# Altium project Evb board STM32H7 Fullcolor V1l0.PrjPcb (part 1 of 2)
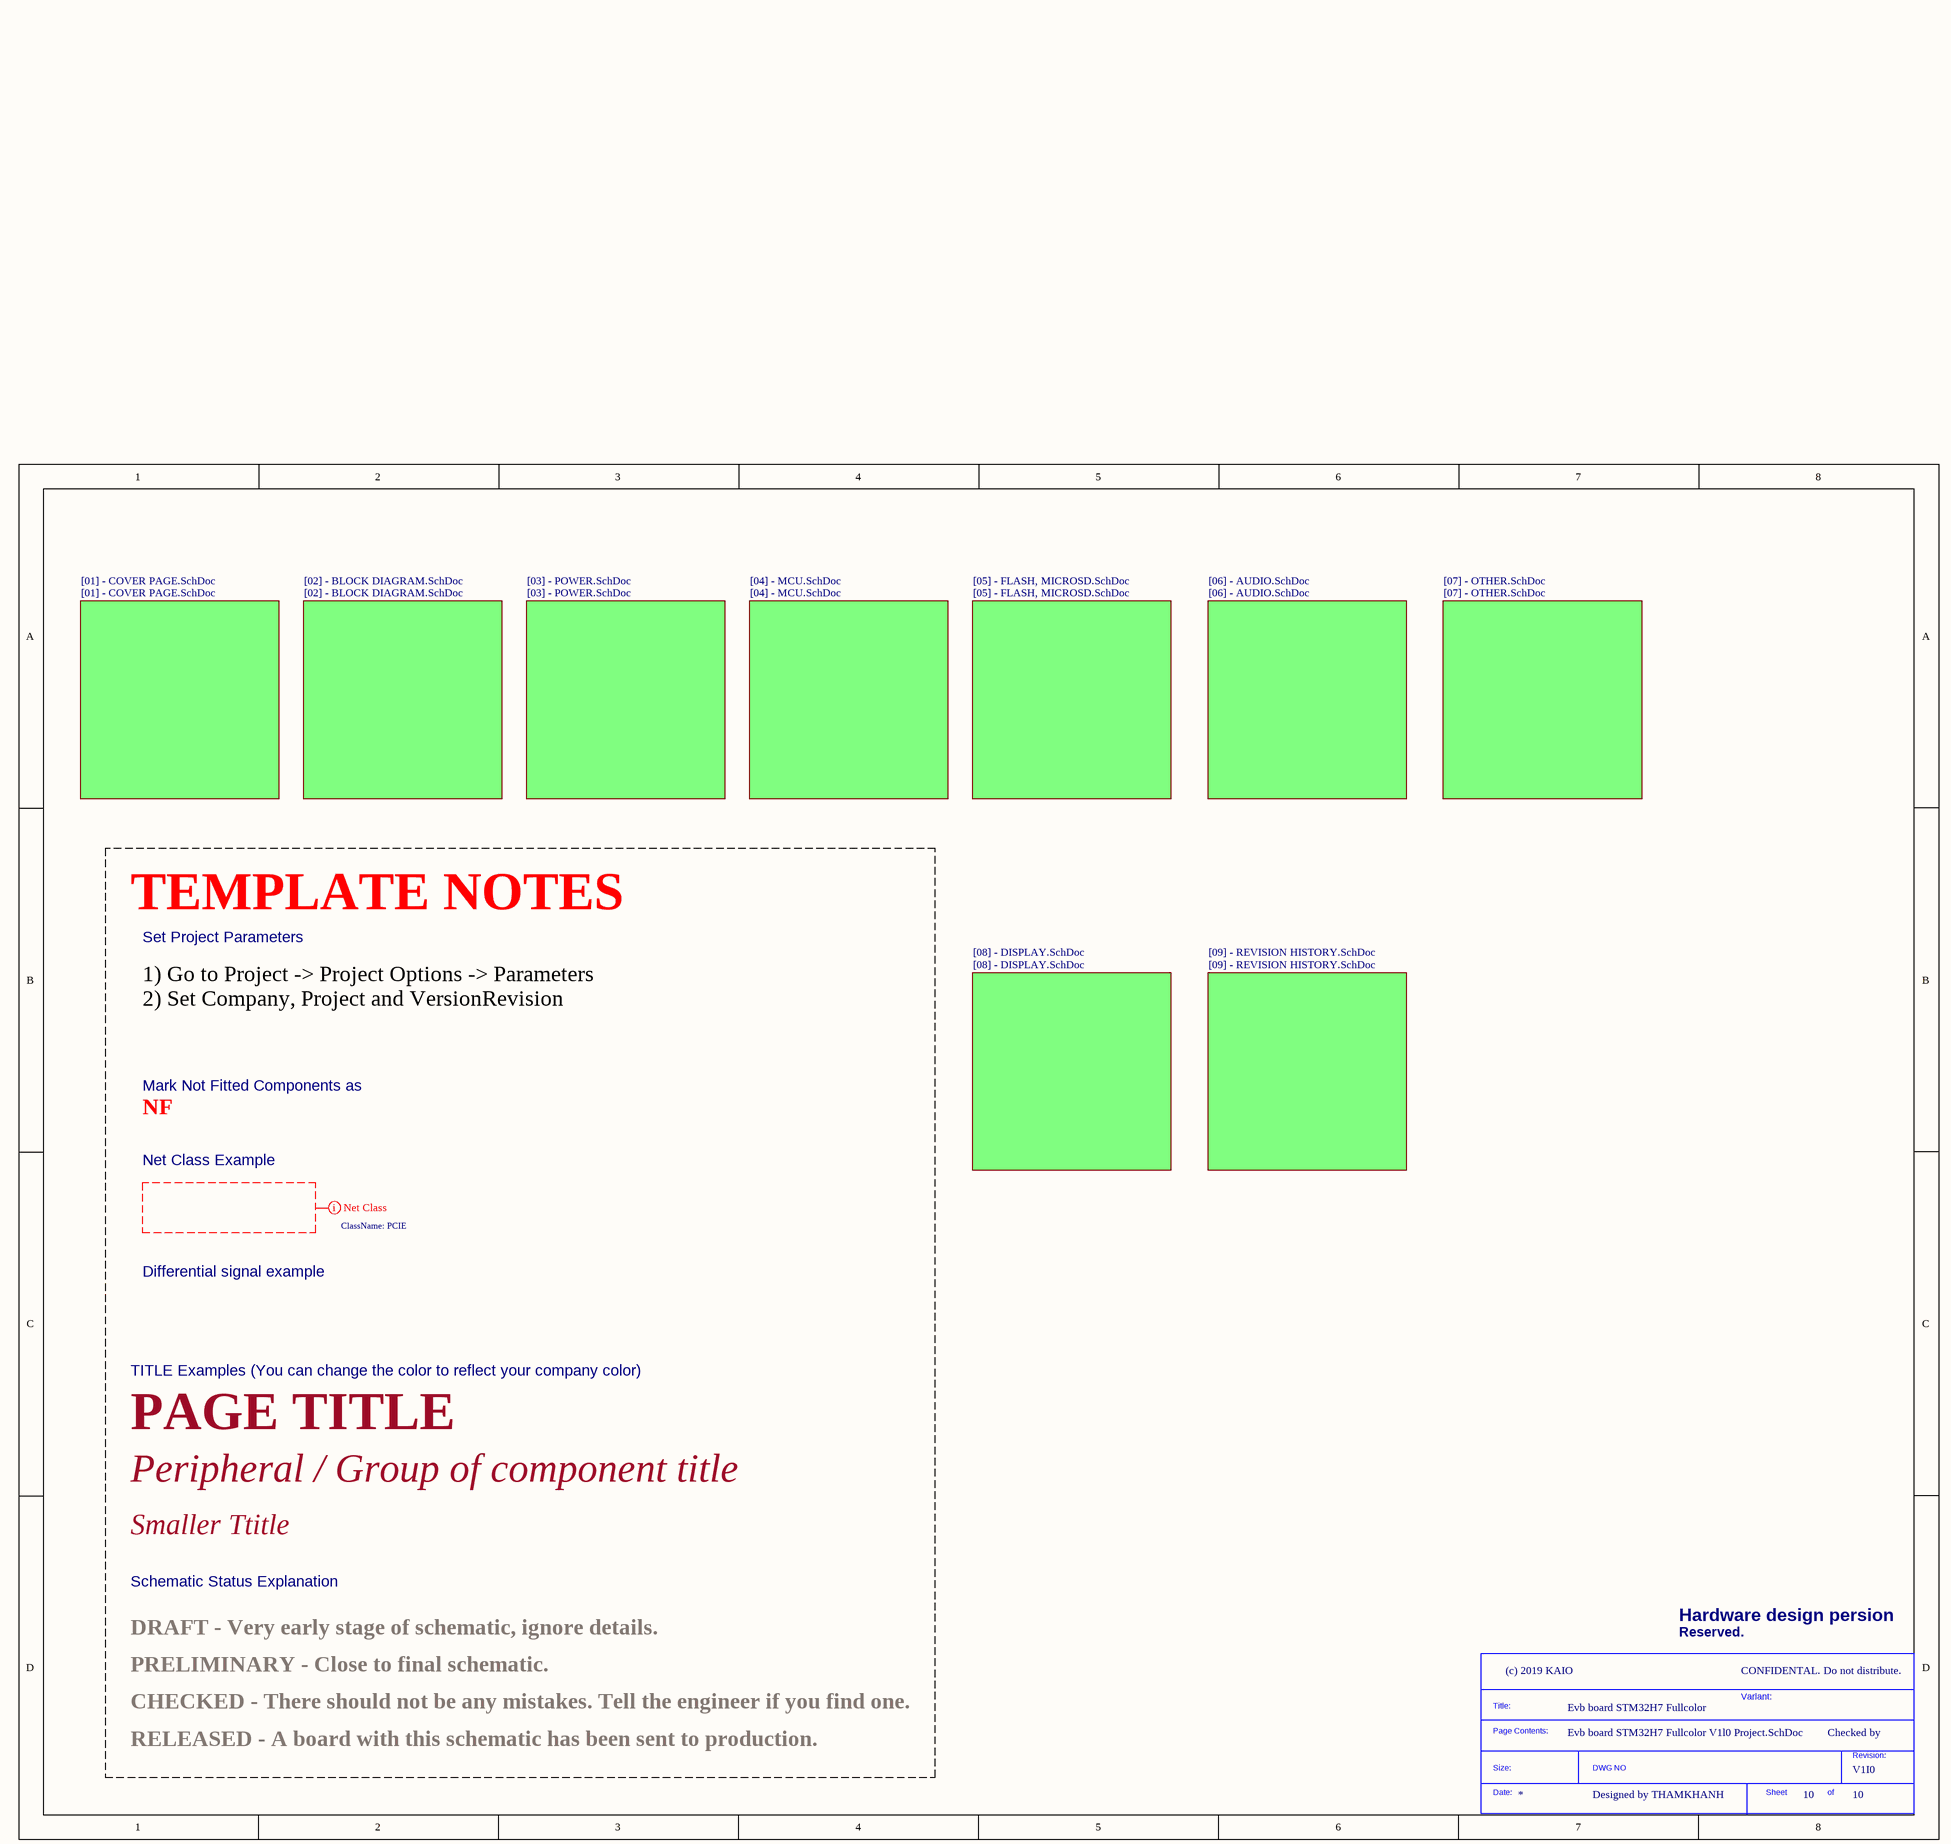
[diagram p0: Evb board STM32H7 Fullcolor V1l0 Project.SchDoc]
ClientCompanyName: KAIO; ClientContactEmail: thamkhanhdev@gmail.com; ClientContactName: Khanh Tham; ClientWebsite: Reserved; Company: (c) 2019 KAIO; Note: FREE for personal.; NotFitted: NF; Project: Evb board STM32H7 Fullcolor; VersionRevision: V1I0
10 sheets, 65 parts. Net scope: flat (ports and power ports of the same name join across sheets).
Board file: Evb board STM32H7 Fullcolor V1l0.PcbDoc
Sheets:
  Evb board STM32H7 Fullcolor V1l0 Project.SchDoc
    [01] - COVER PAGE.SchDoc = [01] - COVER PAGE.SchDoc
    [02] - BLOCK DIAGRAM.SchDoc = [02] - BLOCK DIAGRAM.SchDoc
    [03] - POWER.SchDoc = [03] - POWER.SchDoc
    [04] - MCU.SchDoc = [04] - MCU.SchDoc
    [05] - FLASH, MICROSD.SchDoc = [05] - FLASH, MICROSD.SchDoc
    [06] - AUDIO.SchDoc = [06] - AUDIO.SchDoc
    [07] - OTHER.SchDoc = [07] - OTHER.SchDoc
    [09] - REVISION HISTORY.SchDoc = [09] - REVISION HISTORY.SchDoc
    [08] - DISPLAY.SchDoc = [08] - DISPLAY.SchDoc

## Sheet Evb board STM32H7 Fullcolor V1l0 Project.SchDoc
size A3; CompanyName: FEDEVEL; Organization: FEDEVEL; DocumentNumber: 1; Revision: V1I1; SheetNumber: 10; SheetTotal: 10; PageSetup: Record=PageOptions|CenterHorizontal=True|CenterVertical=True|PrintScale=1.07|XCorrection=1.00|YCorrection=1.00|PrintKind=1|BorderSize=5000000|LeftOffset=0|BottomOffset=0|Orientation=2|PaperLength=1000|PaperWidth=1000|Scale=100|PaperSource=7|PrintQuality=600|MediaType=1|DitherType=10|PaperKind=A3|PrintScaleMode=1; ProjectName: KDS C6A816x Module

### Parts
*  SDTitleBlock  (value not drawn)  (graphical)

### Sub-sheets
[01] - COVER PAGE.SchDoc = [01] - COVER PAGE.SchDoc: no entries
[02] - BLOCK DIAGRAM.SchDoc = [02] - BLOCK DIAGRAM.SchDoc: no entries
[03] - POWER.SchDoc = [03] - POWER.SchDoc: no entries
[04] - MCU.SchDoc = [04] - MCU.SchDoc: no entries
[05] - FLASH, MICROSD.SchDoc = [05] - FLASH, MICROSD.SchDoc: no entries
[06] - AUDIO.SchDoc = [06] - AUDIO.SchDoc: no entries
[07] - OTHER.SchDoc = [07] - OTHER.SchDoc: no entries
[08] - DISPLAY.SchDoc = [08] - DISPLAY.SchDoc: no entries
[09] - REVISION HISTORY.SchDoc = [09] - REVISION HISTORY.SchDoc: no entries

### Layout directives
net class PCIE: (no net found under the mark)

### Notes on the sheet
- TEMPLATE NOTES
- Set Project Parameters
- 1) Go to Project -> Project Options -> Parameters
  2) Set Company, Project and VersionRevision
- NF
- Mark Not Fitted Components as
- Net Class Example
- Differential signal example
- TITLE Examples (You can change the color to reflect your company color)
- PAGE TITLE
- Peripheral / Group of component title
- Smaller Ttitle
- Schematic Status Explanation
- Hardware design persion
- PRELIMINARY - Close to final schematic.
- DRAFT - Very early stage of schematic, ignore details.
- Reserved.
- CONFIDENTAL. Do not distribute.
- CHECKED - There should not be any mistakes. Tell the engineer if you find one.
- Variant:
- Checked by
- RELEASED - A board with this schematic has been sent to production.
- Designed by THAMKHANH
- (in symbol SDTitleBlock) Title:; Page Contents:; Revision:; Size:; DWG NO; Date:; Sheet; of

## Sheet [01] - COVER PAGE.SchDoc
size A3; DocumentNumber: 2; SheetNumber: 1; SheetTotal: 10
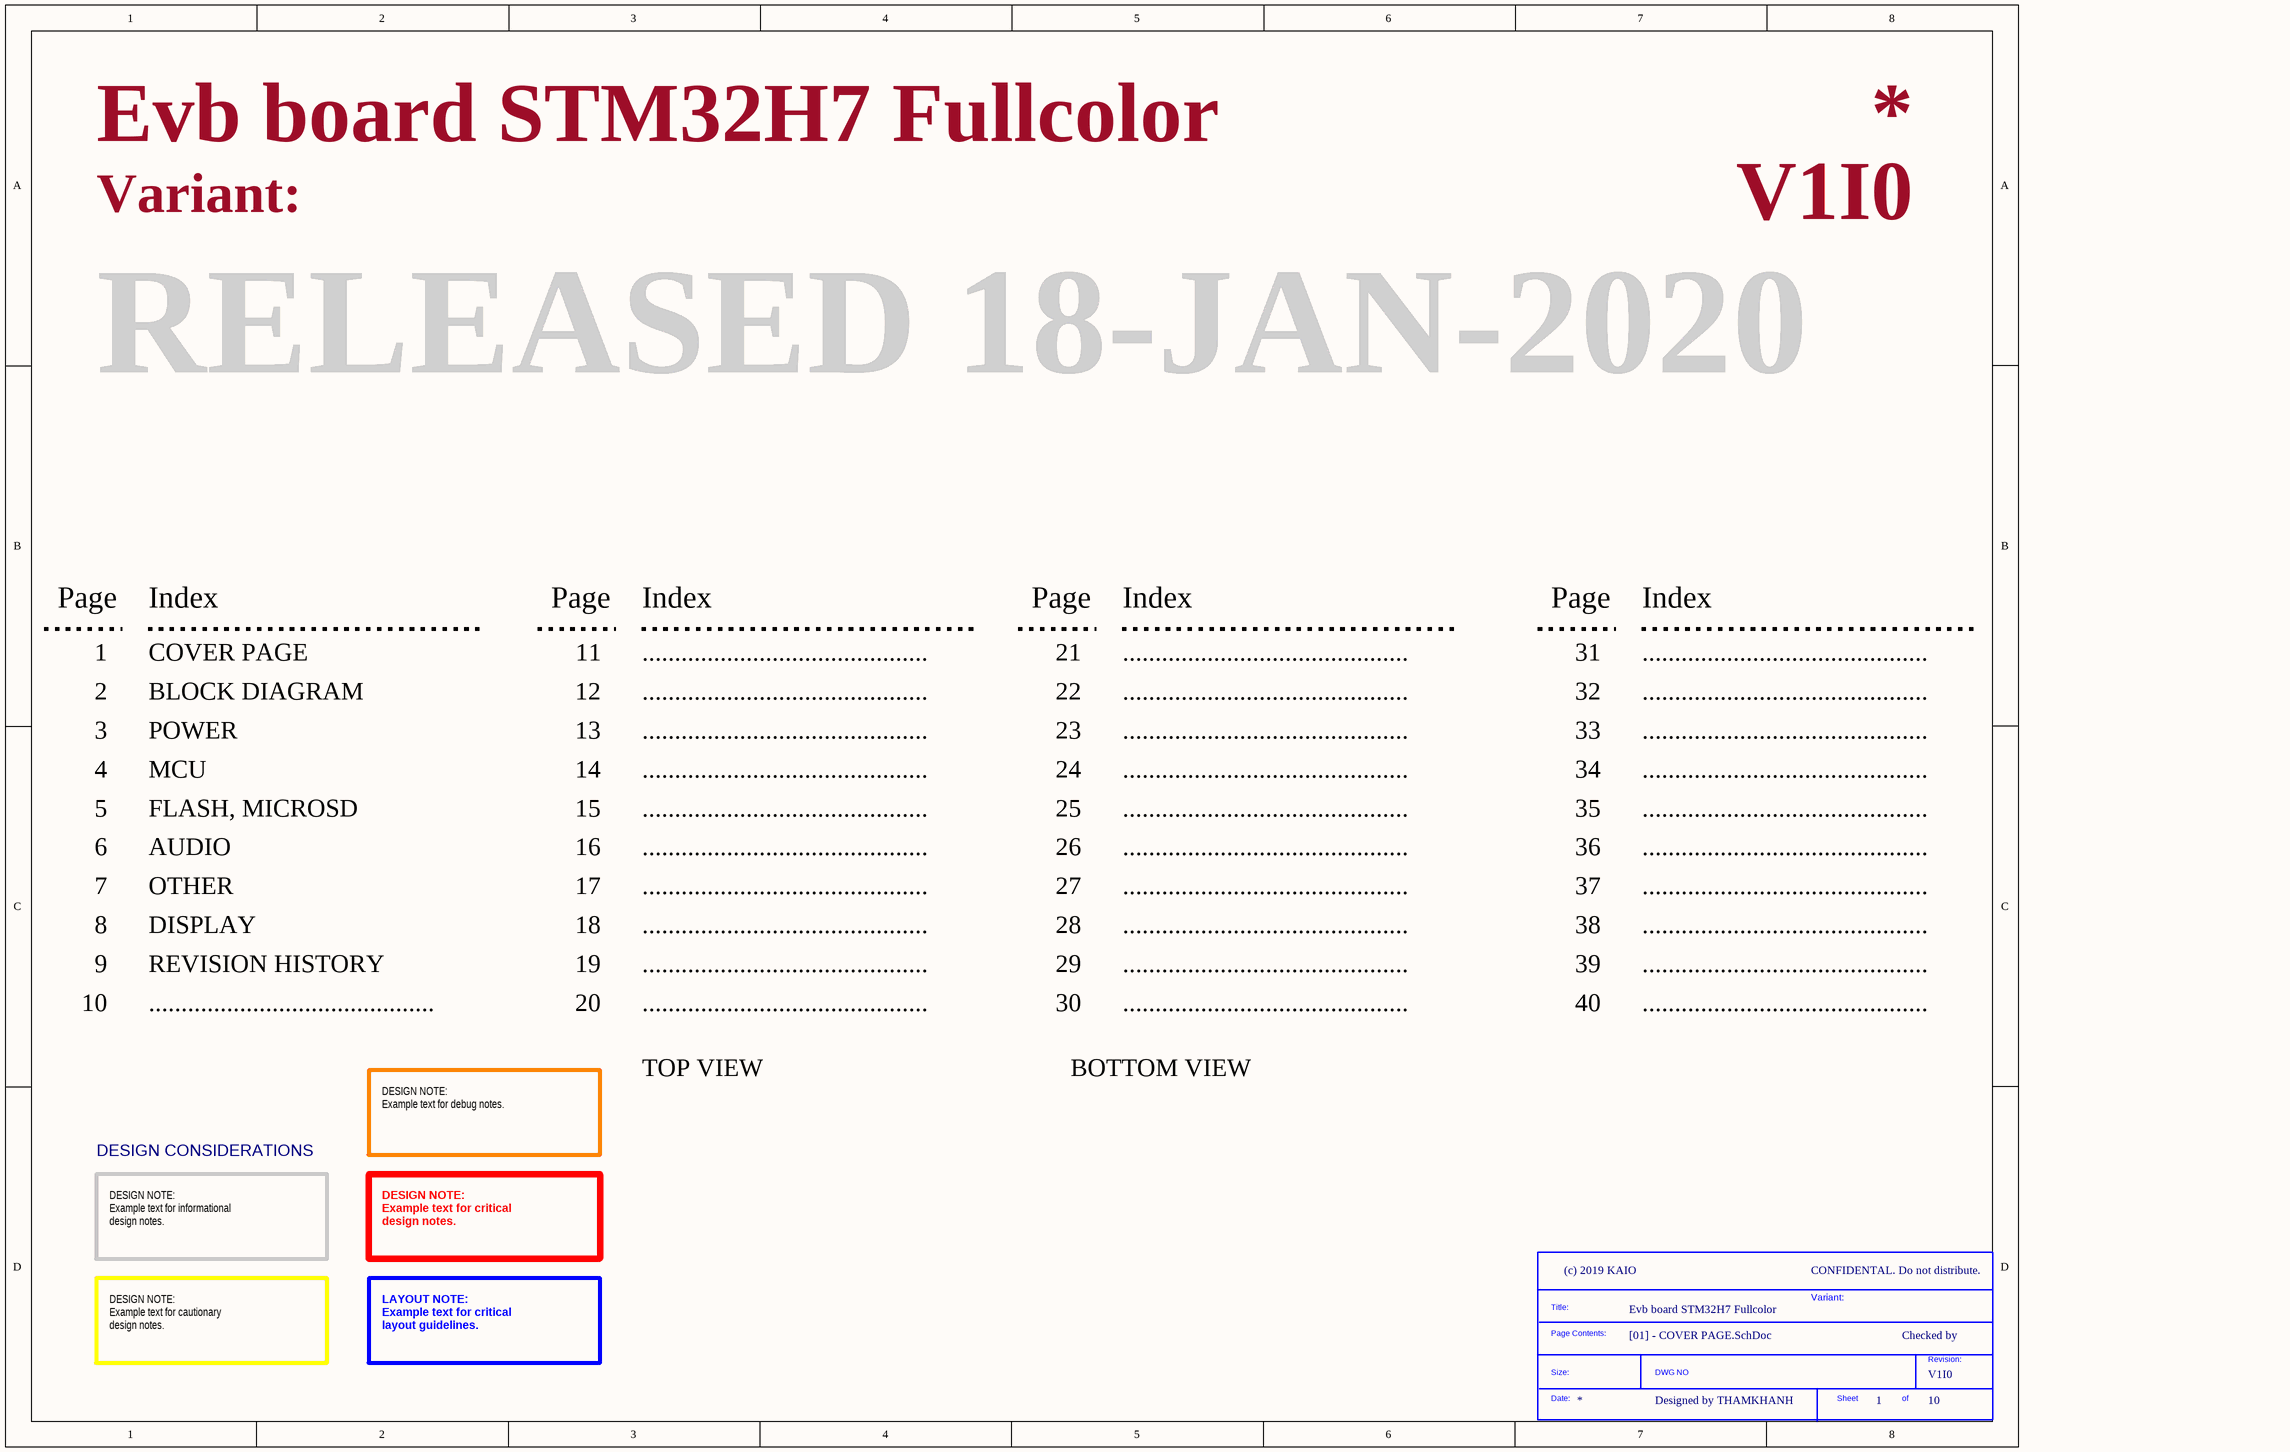
[diagram p1: [01] - COVER PAGE.SchDoc]

### Parts
(Parts that share a designator on the sheet are numbered #1, #2 ... from top to bottom, then left to right.)
*?#1  SDTitleBlock  (value not drawn)  (graphical)

### Notes on the sheet
- Variant:
- RELEASED 18-JAN-2020
- Page
- Index
- 1
- COVER PAGE
- 11
- ............................................
- 21
- 31
- 2
- 3
- BLOCK DIAGRAM
- POWER
- 12
- 13
- 22
- 23
- 32
- 33
- 4
- 5
- MCU
- FLASH, MICROSD
- 14
- 15
- 24
- 25
- 34
- 35
- 6
- AUDIO
- 16
- 26
- 36
- 7
- 8
- DISPLAY
- OTHER
- 17
- 18
- 27
- 28
- 37
- 38
- 9
- 10
- REVISION HISTORY
- 19
- 20
- 29
- 30
- 39
- 40
- TOP VIEW
- BOTTOM VIEW
- DESIGN NOTE:
  Example text for debug notes.
- DESIGN CONSIDERATIONS
- DESIGN NOTE:
  Example text for informational
  design notes.
- DESIGN NOTE:
  Example text for critical
  design notes.
- CONFIDENTAL. Do not distribute.
- Checked by
- DESIGN NOTE:
  Example text for cautionary
  design notes.
- LAYOUT NOTE:
  Example text for critical
  layout guidelines.
- Designed by THAMKHANH
- (in symbol SDTitleBlock) Title:; Page Contents:; Revision:; Size:; DWG NO; Date:; Sheet; of

## Sheet [02] - BLOCK DIAGRAM.SchDoc
size A3; DocumentNumber: 3; SheetNumber: 2; SheetTotal: 10
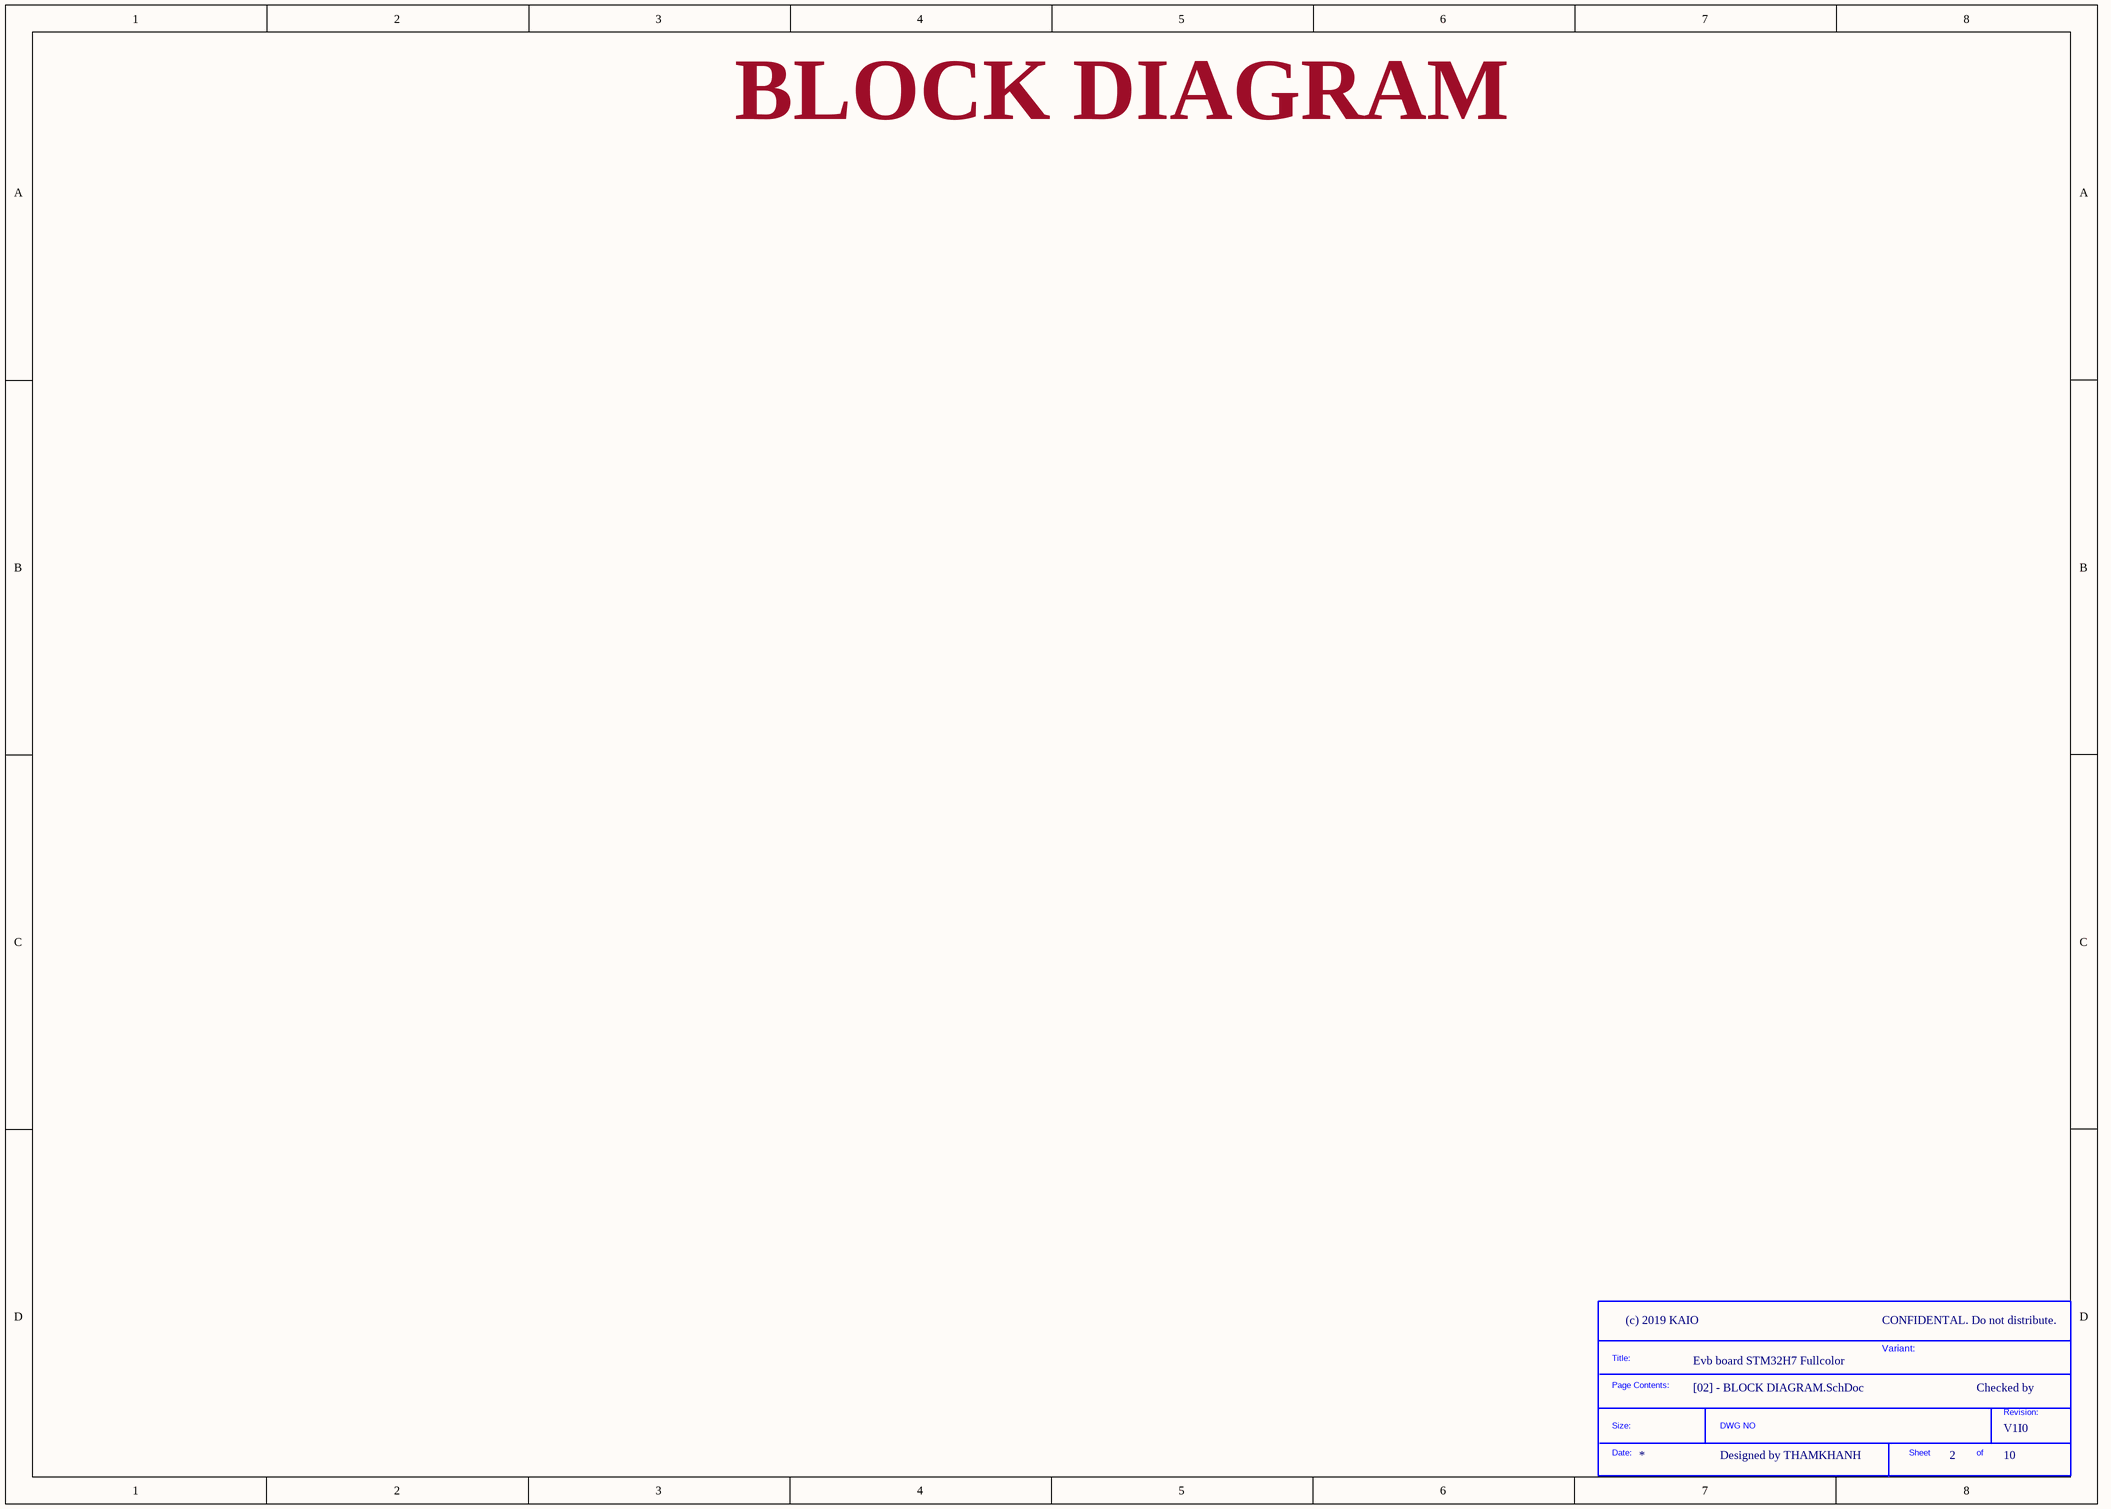
[diagram p2: [02] - BLOCK DIAGRAM.SchDoc]

### Parts
(Parts that share a designator on the sheet are numbered #1, #2 ... from top to bottom, then left to right.)
*?#2  SDTitleBlock  (value not drawn)  (graphical)

### Notes on the sheet
- BLOCK DIAGRAM
- CONFIDENTAL. Do not distribute.
- Variant:
- Checked by
- Designed by THAMKHANH
- (in symbol SDTitleBlock) Title:; Page Contents:; Revision:; Size:; DWG NO; Date:; Sheet; of

## Sheet [03] - POWER.SchDoc
size A3; DocumentNumber: 4; SheetNumber: 3; SheetTotal: 10
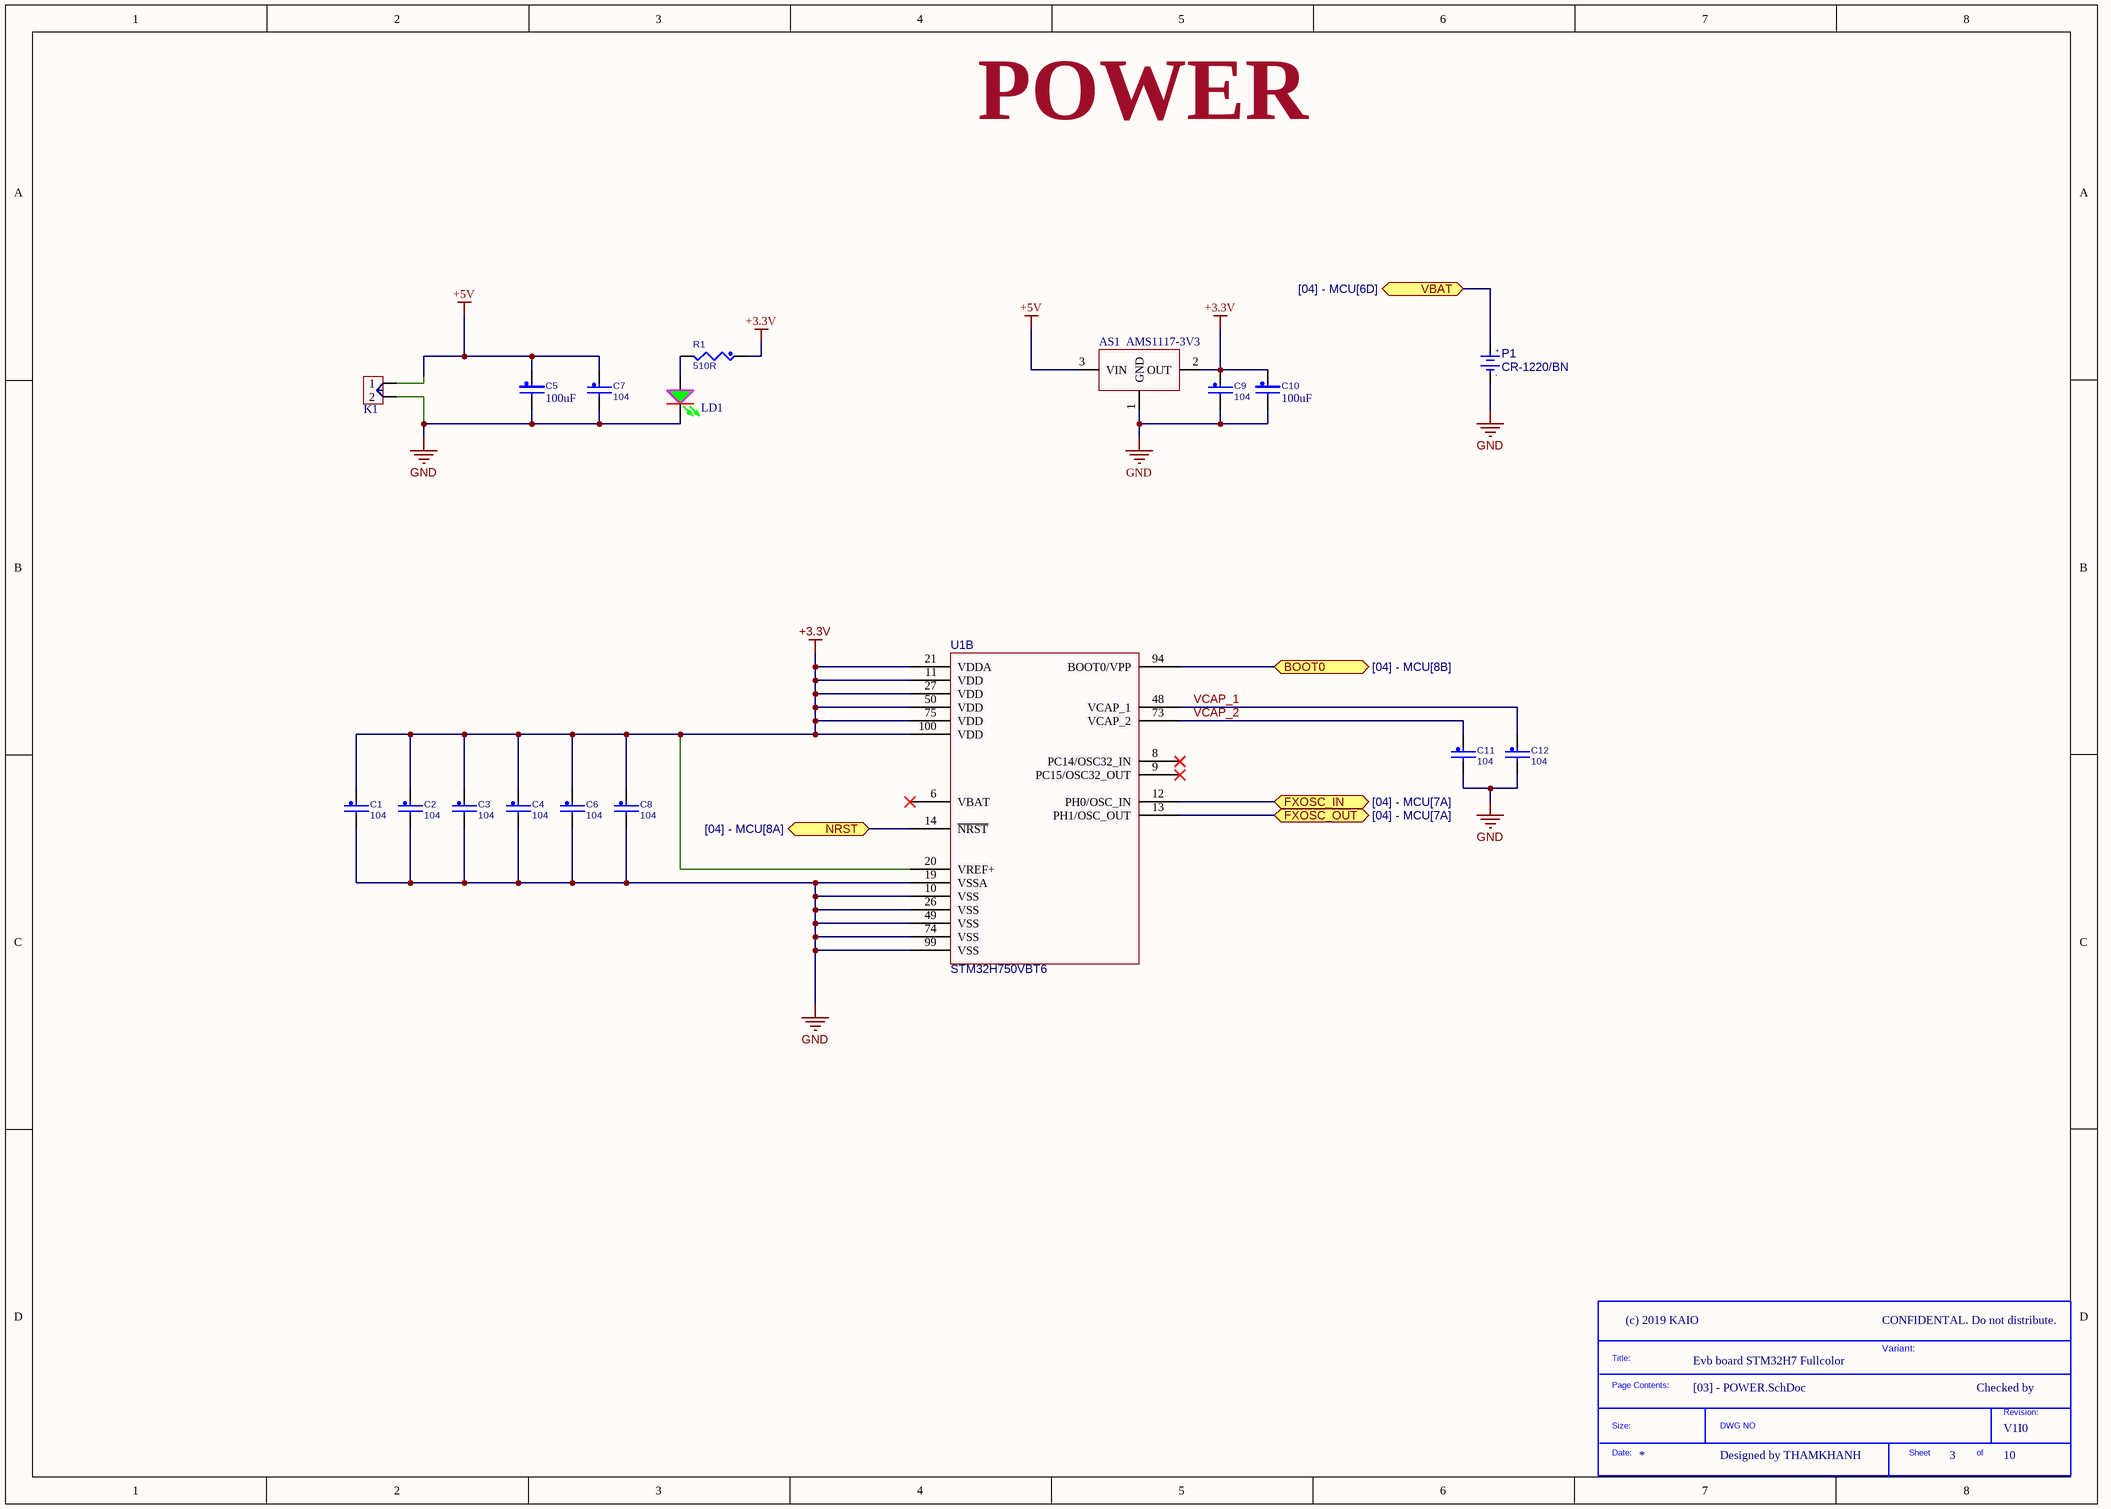
[diagram p3: [03] - POWER.SchDoc]

### Parts
(Parts that share a designator on the sheet are numbered #1, #2 ... from top to bottom, then left to right.)
*?#3  SDTitleBlock  (value not drawn)  (graphical)
AS1  AMS1117-3V3  [SOT223-BCE]
C1  104  [C0603]
C2  104  [C0603]
C3  104  [C0603]
C4  104  [C0603]
C5  100uF  [CAP-TAN-SMD-3530]
C6  104  [C0603]
C7  104  [C0603]
C8  104  [C0603]
C9  104  [C0603]
C10  100uF  [CAP-TAN-SMD-3530]
C11  104  [C0603]
C12  104  [C0603]
K1  KF2  [KF5.08 2DV]  (value not drawn)
LD1  LED SMD  [LED 0805/2012 BLUE]  (value not drawn)
P1  CR-1220/BN  [PIN-CR1220-SMD-NO]
R1  510R  [R0603]
U1  STM32H750VBT6  [QFP50P1400X1400-100N]  (part B of 3)

### Ports
BOOT0 (bidir, see [04] - MCU[8B]), FXOSC_IN (bidir, see [04] - MCU[7A]), FXOSC_OUT (bidir, see [04] - MCU[7A]), NRST (bidir, see [04] - MCU[8A]), VBAT (bidir, see [04] - MCU[6D])

### Nets
+3.3V: AS1.2(OUT) C1.1 C2.1 C3.1 C4.1 C6.1 C8.1 C9.1 C10.1 R1.1 U1.11(VDD) U1.20(VREF+) U1.21(VDDA) U1.27(VDD) U1.50(VDD) U1.75(VDD) U1.100(VDD)
+5V: AS1.3(VIN) C5.1 C7.1 K1.1
GND: AS1.1(GND) C1.2 C2.2 C3.2 C4.2 C5.2 C6.2 C7.2 C8.2 C9.2 C10.2 C11.2 C12.2 K1.2 LD1.2(K) P1.2(GND) U1.10(VSS) U1.19(VSSA) U1.26(VSS) U1.49(VSS) U1.74(VSS) U1.99(VSS)
BOOT0: U1.94(BOOT0/VPP) ; port BOOT0
FXOSC_IN: U1.12(PH0/OSC_IN) ; port FXOSC_IN
FXOSC_OUT: U1.13(PH1/OSC_OUT) ; port FXOSC_OUT
NRST: U1.14(~{NRST}) ; port NRST
VBAT: P1.1(+3V) ; port VBAT
VCAP_1: C12.1 U1.48(VCAP_1)
VCAP_2: C11.1 U1.73(VCAP_2)
NetLD1_1: LD1.1(A) R1.2

Not connected (* = marked no-connect by the designer): U1 6(VBAT)* 8(PC14/OSC32_IN)* 9(PC15/OSC32_OUT)*

### Notes on the sheet
- POWER
- CONFIDENTAL. Do not distribute.
- Variant:
- Checked by
- Designed by THAMKHANH
- (in symbol PIN-CR-1220/BN) +; -
- (in symbol SDTitleBlock) Title:; Page Contents:; Revision:; Size:; DWG NO; Date:; Sheet; of

### Library data of the parts
AS1 = AMS1117-3V3: 800mA Low-Dropout Linear Regulator
C1-C4 C6-C9 C11 C12 = CAP-SMD-CERAMIC: Surface Mound Multilayer Ceramic Chip Capacitor (SMD MLCC); Manufacturer: TDK Corporation; Manufacturer Part Number: C2012X5R1C226K; Capacitance: 22pF; Voltage - Rated: 16V; Tolerance: ±10%; Temperature Coefficient: X5R; .Checked PCB: RF; RoHS: RoHS Compliant; Category: Capacitors; Mounting Type: Surface Mount, MLCC; Operating Temperature: -55°C ~ 85°C; Applications: General Purpose; Ratings: -; Package / Case: 0805 (2012 Metric); Size / Dimension: 0.079" L x 0.049" W (2.00mm x 1.25mm); Height - Seated (Max): -; Thickness (Max): 0.057" (1.45mm); Lead Spacing: -; Features: -; Packaging: Cut Tape (CT); Lead Style: -; ComponentLink1URL: http://www.tdk.com/pdf/general_B11.pdf; ComponentLink1Description: http://www.tdk.com/pdf/general_B11.pdf; .Checked SCH: RF
C5 C10 = CAP-SMD-TANTALUM: Tantalum capacitor , T491A475K016AT, KEMET; Manufacturer Part Number: T491A105K016AT; Capacitance: 1uF; Tolerance: 20%; Voltage Rating: 16V; ESR (Equivalent Series Resistance): 10R; Leakage Current: 500nA; Polarity: Polar; Dissipation Factor: 4%; Life (Hours): 2000Hour; Ripple Current: 87mA; Manufacturer: KEMET; Mount: Surface Mount,PCB; Case/Package: 1206; Number of Pins: 2; Case Code (Imperial): 1206; Case Code (Metric): 3216; Dielectric Material: Tantalum; Min Operating Temperature: -55°C; Max Operating Temperature: 125°C; Packaging: Tape and Reel; Package Quantity: 1; Voltage Rating (DC): 16V; Termination: SMD/SMT; Voltage: 16V; Features: General Purpose; Length: 3.2mm; Height: 1.6mm; Width: 1.6mm; Height - Seated (Max): 0.071inch; Depth: 1.6mm; REACH SVHC: No SVHC; Lead Free: Lead Free; ComponentLink1URL: https://4donline.ihs.com/images/VipMasterIC/IC/KEME/KEME-S-A0006487387/KEME-S-A0006487387-1.pdf?hkey=52A5661711E402568146F3353EA87419&src-supplier=Element14; ComponentLink1Description: https://4donline.ihs.com/images/VipMasterIC/IC/KEME/KEME-S-A0006487387/KEME-S-A0006487387-1.pdf?hkey=52A5661711E402568146F3353EA87419&src-supplier=Element14; ComponentLink2URL: http://www.rapidonline.com/pdf/458280_da_en_01.pdf?src-supplier=Rapid+Electronics; ComponentLink2Description: http://www.rapidonline.com/pdf/458280_da_en_01.pdf?src-supplier=Rapid+Electronics; ComponentLink3URL: http://www.jameco.com/Jameco/Products/ProdDS/1573169.pdf?src-supplier=Jameco; ComponentLink3Description: http://www.jameco.com/Jameco/Products/ProdDS/1573169.pdf?src-supplier=Jameco; ComponentLink4URL: http://www.kemet.com/kemet/web/homepage/kechome.nsf/file/T491%20Series/$file/KEM_T2005_T491.pdf?src-supplier=Farnell; ComponentLink4Description: http://www.kemet.com/kemet/web/homepage/kechome.nsf/file/T491%20Series/$file/KEM_T2005_T491.pdf?src-supplier=Farnell; ComponentLink5URL: http://www.mouser.com/ds/2/212/KEM_T2005_T491-1093550.pdf?src-supplier=Mouser; ComponentLink5Description: http://www.mouser.com/ds/2/212/KEM_T2005_T491-1093550.pdf?src-supplier=Mouser; ComponentLink6URL: https://www.distrelec.biz/Web/Downloads/_t/ds/KEM_T2005_T491_eng_tds.pdf?mime=application%2Fpdf&src-supplier=Distrelec; ComponentLink6Description: https://www.distrelec.biz/Web/Downloads/_t/ds/KEM_T2005_T491_eng_tds.pdf?mime=application%2Fpdf&src-supplier=Distrelec; ComponentLink7URL: https://api.kemet.com/component-edge/download/datasheet/T491A105K016AT.pdf?src-supplier=Digi-Key; ComponentLink7Description: https://api.kemet.com/component-edge/download/datasheet/T491A105K016AT.pdf?src-supplier=Digi-Key; ComponentLink8URL: http://www.kemet.com/kemet/web/homepage/kechome.nsf/file/T491%20Series/$file/KEM_T2005_T491.pdf?src-supplier=Element14; ComponentLink8Description: http://www.kemet.com/kemet/web/homepage/kechome.nsf/file/T491%20Series/$file/KEM_T2005_T491.pdf?src-supplier=Element14; ComponentLink9URL: http://uk.rs-online.com/webdocs/1529/0900766b815290c9.pdf?src-supplier=RSComponents; ComponentLink9Description: http://uk.rs-online.com/webdocs/1529/0900766b815290c9.pdf?src-supplier=RSComponents; ComponentLink10URL: https://www.alliedelec.com/m/d/1172a60f7bb3eb66344f86e8fb9ddbde.pdf?src-supplier=Allied+Electronics; ComponentLink10Description: https://www.alliedelec.com/m/d/1172a60f7bb3eb66344f86e8fb9ddbde.pdf?src-supplier=Allied+Electronics; Radiation Hardening: No; ComponentLink11URL: https://api.kemet.com/component-edge/download/datasheet/T491A475K016AT.pdf?src-supplier=Digi-Key; ComponentLink11Description: https://api.kemet.com/component-edge/download/datasheet/T491A475K016AT.pdf?src-supplier=Digi-Key; ComponentLink12URL: http://www.jameco.com/Jameco/Products/ProdDS/1573425.pdf?src-supplier=Jameco; ComponentLink12Description: http://www.jameco.com/Jameco/Products/ProdDS/1573425.pdf?src-supplier=Jameco; ComponentLink13URL: http://uk.rs-online.com/webdocs/1515/0900766b81515525.pdf?src-supplier=RSComponents; ComponentLink13Description: http://uk.rs-online.com/webdocs/1515/0900766b81515525.pdf?src-supplier=RSComponents; ComponentLink14URL: http://www.farnell.com/datasheets/1854511.pdf?src-supplier=Element14; ComponentLink14Description: http://www.farnell.com/datasheets/1854511.pdf?src-supplier=Element14; ComponentLink15URL: http://www.rapidonline.com/pdf/458253_da_en_01.pdf?src-supplier=Rapid+Electronics; ComponentLink15Description: http://www.rapidonline.com/pdf/458253_da_en_01.pdf?src-supplier=Rapid+Electronics; ComponentLink16URL: https://produktinfo.conrad.com/datenblaetter/450000-474999/458253-da-01-en-TANTAL_KONDENSATOR_T491A475K016AT.pdf?src-supplier=Conrad; ComponentLink16Description: https://produktinfo.conrad.com/datenblaetter/450000-474999/458253-da-01-en-TANTAL_KONDENSATOR_T491A475K016AT.pdf?src-supplier=Conrad
K1 = KF2: KF2, 5.08mm, 10A, 300V, -40C ~ 105C
LD1 = LED SMD: LED DIFFUSED SMD
P1 = PIN-CR-1220/BN: PANASONIC - CR-1220/BN - BATTERY, LITHIUM, CR1220; Capacity: 35mAh; Voltage Rating (DC): 3V; Outside Diameter: 12.5mm; Manufacturer: Panasonic; Manufacturer Part Number: CR-1220/BN; Weight: 1.2g; Min Operating Temperature: -30°C; Max Operating Temperature: 60°C; Chemistry/Technology: Lithium; Termination: Standard; Diameter: 12.5mm; Height: 2mm; Lead Free: Lead Free; REACH SVHC: Yes; ComponentLink1URL: http://uk.rs-online.com/webdocs/0c85/0900766b80c85259.pdf?src-supplier=RSComponents; ComponentLink1Description: http://uk.rs-online.com/webdocs/0c85/0900766b80c85259.pdf?src-supplier=RSComponents
R1 = RES-SMD: RES 0R OHM 1/8W 1% SMD; Manufacturer: Yageo; Manufacturer Part Number: RC0402FR-0749R9L; Power (Watts): 0.063W, 1/16W; .Checked PCB: used; Temperature Coefficient: ±100ppm/°C; Resistance: 3.3kR; Power Rating: 125mW; Voltage Rating: 100V; Category: Resistors; Supplier Part Number: 311-49.9LRCT-ND; Package / Case: 0402 (1005 Metric); Price 1k [$]: 0.01421; Tolerance: ±1%; Value: 0R; .Checked SCH: used; Supplier: Digikey; RoHS: RoHS Compliant; Composition: Thick Film; Features: -; Size / Dimension: 0.039" L x 0.020" W (1.00mm x 0.50mm); Height: 0.016" (0.40mm); Number of Terminations: 2; Packaging: Cut Tape (CT); ComponentLink1URL: http://www.yageo.com/documents/recent/PYu-RC0402_51_RoHS_L_6.pdf; ComponentLink1Description: http://www.yageo.com/documents/recent/PYu-RC0402_51_RoHS_L_6.pdf; Resistance (Ohms): 0R; Mount: Surface Mount; Case/Package: 0805; Number of Pins: 2; Contact Plating: Tin; Case Code (Metric): 2012; Case Code (Imperial): 0805; Min Operating Temperature: -55°C; Max Operating Temperature: 155°C; Package Quantity: 1; Termination: SMD/SMT; Military Standard: Not; Max Power Dissipation: 125mW; Voltage Rating (DC): 100V; Length: 2mm; Width: 1.25mm; Depth: 1.25mm; Radiation Hardening: No; REACH SVHC: No SVHC; Lead Free: Lead Free; ComponentLink2URL: http://www.farnell.com/datasheets/485442.pdf?src-supplier=Farnell; ComponentLink2Description: http://www.farnell.com/datasheets/485442.pdf?src-supplier=Farnell; ComponentLink3URL: http://uk.rs-online.com/webdocs/0bee/0900766b80beefcc.pdf?src-supplier=RSComponents; ComponentLink3Description: http://uk.rs-online.com/webdocs/0bee/0900766b80beefcc.pdf?src-supplier=RSComponents; ComponentLink4URL: http://industrial.panasonic.com/www-data/pdf/AOA0000/AOA0000CE26.pdf?src-supplier=Future+Electronics; ComponentLink4Description: http://industrial.panasonic.com/www-data/pdf/AOA0000/AOA0000CE26.pdf?src-supplier=Future+Electronics; ComponentLink5URL: https://www.alliedelec.com/m/d/b6b0537e86f421aa7f5975bb1d8f429a.pdf?src-supplier=Allied+Electronics; ComponentLink5Description: https://www.alliedelec.com/m/d/b6b0537e86f421aa7f5975bb1d8f429a.pdf?src-supplier=Allied+Electronics; ComponentLink6URL: http://industrial.panasonic.com/www-data/pdf/AOA0000/AOA0000CE26.pdf?src-supplier=Avnet; ComponentLink6Description: http://industrial.panasonic.com/www-data/pdf/AOA0000/AOA0000CE26.pdf?src-supplier=Avnet; ComponentLink7URL: http://industrial.panasonic.com/www-data/pdf/AOA0000/AOA0000CE26.pdf?src-supplier=Avnet+Europe; ComponentLink7Description: http://industrial.panasonic.com/www-data/pdf/AOA0000/AOA0000CE26.pdf?src-supplier=Avnet+Europe; ComponentLink8URL: http://industrial.panasonic.com/cdbs/www-data/pdf/RDM0000/AOA0000C307.pdf?src-supplier=Farnell; ComponentLink8Description: http://industrial.panasonic.com/cdbs/www-data/pdf/RDM0000/AOA0000C307.pdf?src-supplier=Farnell; ComponentLink9URL: https://www.distrelec.biz/Web/Downloads/_t/ds/ERA_eng_tds.pdf?mime=application%2Fpdf&src-supplier=Distrelec; ComponentLink9Description: https://www.distrelec.biz/Web/Downloads/_t/ds/ERA_eng_tds.pdf?mime=application%2Fpdf&src-supplier=Distrelec; ComponentLink10URL: http://www.farnell.com/datasheets/485442.pdf?src-supplier=Element14; ComponentLink10Description: http://www.farnell.com/datasheets/485442.pdf?src-supplier=Element14; ComponentLink11URL: http://www.farnell.com/datasheets/2052875.pdf?src-supplier=Farnell; ComponentLink11Description: http://www.farnell.com/datasheets/2052875.pdf?src-supplier=Farnell; ComponentLink12URL: http://www.farnell.com/datasheets/2059650.pdf?src-supplier=Farnell; ComponentLink12Description: http://www.farnell.com/datasheets/2059650.pdf?src-supplier=Farnell; ComponentLink13URL: https://produktinfo.conrad.com/datenblaetter/450000-474999/453184-da-01-en-WIDERSTAND_0805_ERA.pdf?src-supplier=Conrad; ComponentLink13Description: https://produktinfo.conrad.com/datenblaetter/450000-474999/453184-da-01-en-WIDERSTAND_0805_ERA.pdf?src-supplier=Conrad
U1 = STM32H750VBT6: STMICROELECTRONICS - STM32H750VBT6 - MCU, 32BIT, 400MHZ, LQFP-100; Interface: I2C,SPI,Ethernet,IrDA,MMC,SDIO,SD,UART,EBI/EMI; Peripherals: Brown-out Detect/Reset,POR,PWM,WDT,DMA,LCD; Memory Type: FLASH; Core Architecture: ARM; Frequency: 480MHz; Number of I/Os: 82; Memory Size: 128KB; Oscillator Type: Internal; Manufacturer: STMicroelectronics; Manufacturer Part Number: STM32H750VBT6; Mount: Surface Mount; Case/Package: LQFP; Min Operating Temperature: -40°C; Max Operating Temperature: 85°C; Packaging: Tray; ComponentLink1URL: http://www.farnell.com/datasheets/2710930.pdf?src-supplier=Farnell; ComponentLink1Description: http://www.farnell.com/datasheets/2710930.pdf?src-supplier=Farnell; ComponentLink2URL: https://www.st.com/resource/en/errata_sheet/dm00399555.pdf?src-supplier=Digi-Key; ComponentLink2Description: https://www.st.com/resource/en/errata_sheet/dm00399555.pdf?src-supplier=Digi-Key; ComponentLink3URL: http://www.farnell.com/datasheets/2710930.pdf?src-supplier=Element14; ComponentLink3Description: http://www.farnell.com/datasheets/2710930.pdf?src-supplier=Element14; ComponentLink4URL: http://www.farnell.com/datasheets/2710930.pdf?src-supplier=Newark; ComponentLink4Description: http://www.farnell.com/datasheets/2710930.pdf?src-supplier=Newark

## Sheet [04] - MCU.SchDoc
size A3; DocumentNumber: 5; SheetNumber: 4; SheetTotal: 10
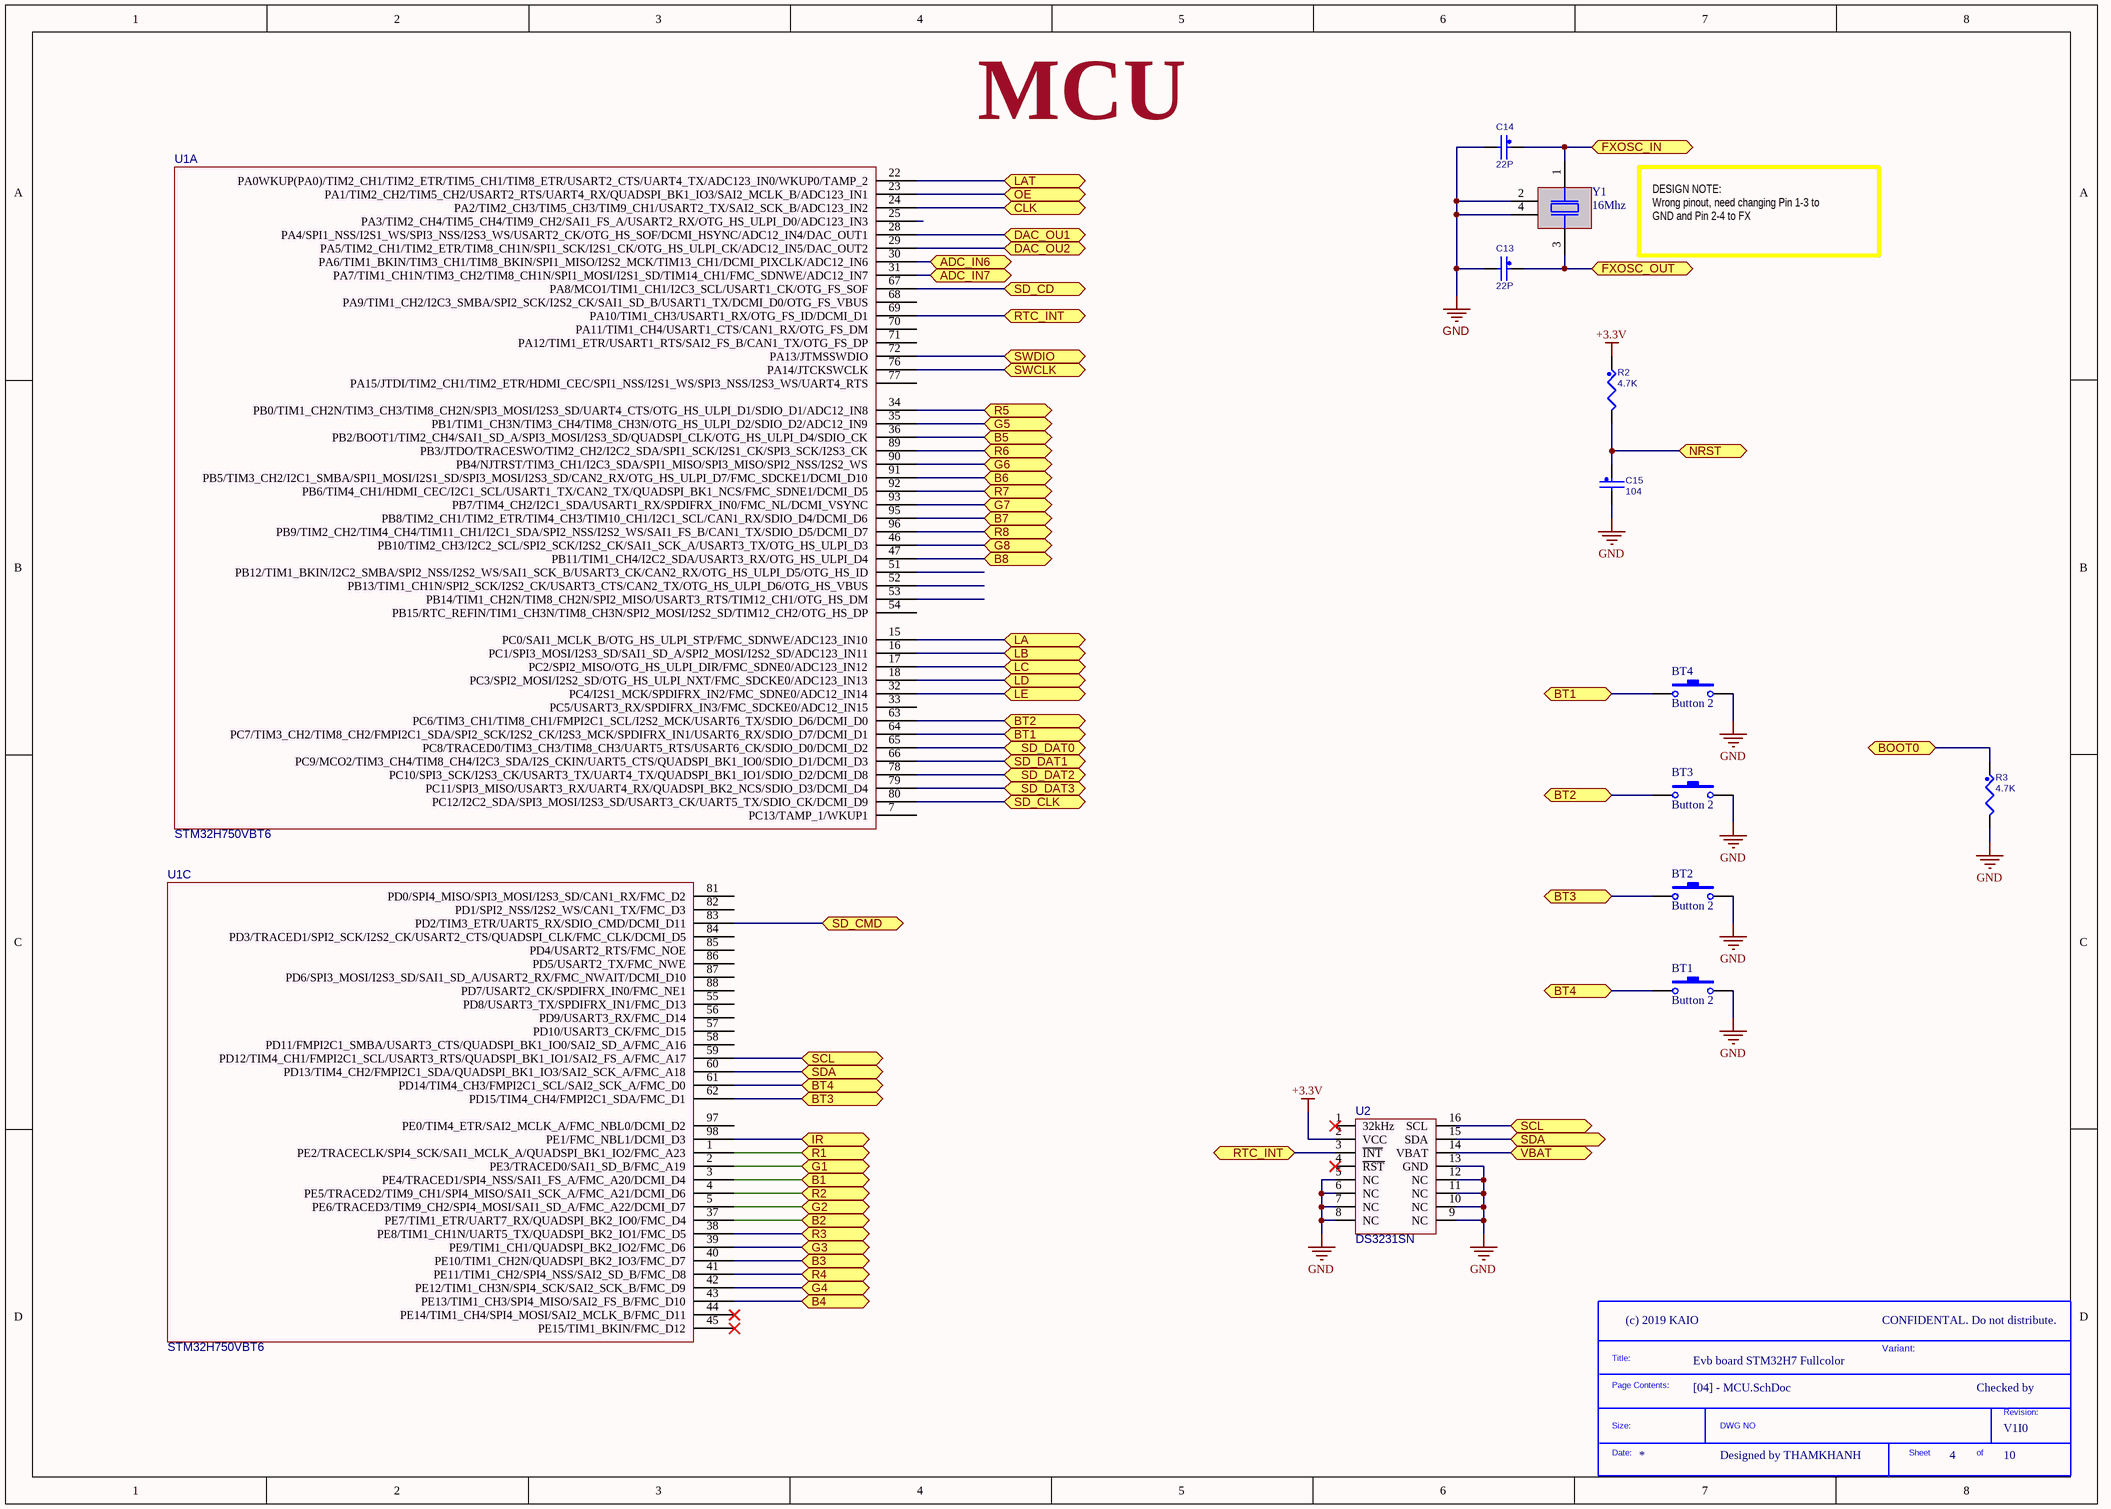
[diagram p4: [04] - MCU.SchDoc]

### Parts
(Parts that share a designator on the sheet are numbered #1, #2 ... from top to bottom, then left to right.)
*?#4  SDTitleBlock  (value not drawn)  (graphical)
BT1  Button 2  [BT-2P0604B1V]
BT2  Button 2  [BT-2P0604B1V]
BT3  Button 2  [BT-2P0604B1V]
BT4  Button 2  [BT-2P0604B1V]
C13  22P  [C0603]
C14  22P  [C0603]
C15  104  [C0603]
R2  4.7K  [R0603]
R3  4.7K  [R0603]
U1  STM32H750VBT6  [QFP50P1400X1400-100N]  (parts A,C of 3)
U2  DS3231SN  [SOIC127P750X1030-16N]
Y1  16Mhz  [XT4-2520NX-SA]

### Ports
ADC_IN6 (bidir), ADC_IN7 (bidir), B1 (bidir), B2 (bidir), B3 (bidir), B4 (bidir), B5 (bidir), B6 (bidir), B7 (bidir), B8 (bidir), BOOT0 (bidir), BT1 (bidir), BT2 (bidir), BT3 (bidir), BT4 (bidir), CLK (bidir), DAC_OU1 (bidir), DAC_OU2 (bidir), FXOSC_IN (bidir), FXOSC_OUT (bidir), G1 (bidir), G2 (bidir), G3 (bidir), G4 (bidir), G5 (bidir), G6 (bidir), G7 (bidir), G8 (bidir), IR (bidir), LA (bidir), LAT (bidir), LB (bidir), LC (bidir), LD (bidir), LE (bidir), NRST (bidir), OE (bidir), R1 (bidir), R2 (bidir), R3 (bidir), R4 (bidir), R5 (bidir), R6 (bidir), R7 (bidir), R8 (bidir), RTC_INT (bidir), SCL (bidir), SD_CD (bidir), SD_CLK (bidir), SD_CMD (bidir), SD_DAT0 (bidir), SD_DAT1 (bidir), SD_DAT2 (bidir), SD_DAT3 (bidir), SDA (bidir), SWCLK (bidir), SWDIO (bidir), VBAT (bidir)

### Nets
+3.3V: R2.1 U2.2(VCC)
GND: BT1.2 BT2.2 BT3.2 BT4.2 C13.2 C14.2 C15.2 R3.2 U2.5(NC) U2.6(NC) U2.7(NC) U2.8(NC) U2.9(NC) U2.10(NC) U2.11(NC) U2.12(NC) U2.13(GND) Y1.2(GND) Y1.4(GND)
ADC_IN6: U1.30(PA6/TIM1_BKIN/TIM3_CH1/TIM8_BKIN/SPI1_MISO/I2S2_MCK/TIM13_CH1/DCMI_PIXCLK/ADC12_IN6) ; port ADC_IN6
ADC_IN7: U1.31(PA7/TIM1_CH1N/TIM3_CH2/TIM8_CH1N/SPI1_MOSI/I2S1_SD/TIM14_CH1/FMC_SDNWE/ADC12_IN7) ; port ADC_IN7
B1: U1.3(PE4/TRACED1/SPI4_NSS/SAI1_FS_A/FMC_A20/DCMI_D4) ; port B1
B2: U1.37(PE7/TIM1_ETR/UART7_RX/QUADSPI_BK2_IO0/FMC_D4) ; port B2
B3: U1.40(PE10/TIM1_CH2N/QUADSPI_BK2_IO3/FMC_D7) ; port B3
B4: U1.43(PE13/TIM1_CH3/SPI4_MISO/SAI2_FS_B/FMC_D10) ; port B4
B5: U1.36(PB2/BOOT1/TIM2_CH4/SAI1_SD_A/SPI3_MOSI/I2S3_SD/QUADSPI_CLK/OTG_HS_ULPI_D4/SDIO_CK) ; port B5
B6: U1.91(PB5/TIM3_CH2/I2C1_SMBA/SPI1_MOSI/I2S1_SD/SPI3_MOSI/I2S3_SD/CAN2_RX/OTG_HS_ULPI_D7/FMC_SDCKE1/DCMI_D10) ; port B6
B7: U1.95(PB8/TIM2_CH1/TIM2_ETR/TIM4_CH3/TIM10_CH1/I2C1_SCL/CAN1_RX/SDIO_D4/DCMI_D6) ; port B7
B8: U1.47(PB11/TIM1_CH4/I2C2_SDA/USART3_RX/OTG_HS_ULPI_D4) ; port B8
BOOT0: R3.1 ; port BOOT0
BT1: BT4.1 U1.64(PC7/TIM3_CH2/TIM8_CH2/FMPI2C1_SDA/SPI2_SCK/I2S2_CK/I2S3_MCK/SPDIFRX_IN1/USART6_RX/SDIO_D7/DCMI_D1) ; port BT1
BT2: BT3.1 U1.63(PC6/TIM3_CH1/TIM8_CH1/FMPI2C1_SCL/I2S2_MCK/USART6_TX/SDIO_D6/DCMI_D0) ; port BT2
BT3: BT2.1 U1.62(PD15/TIM4_CH4/FMPI2C1_SDA/FMC_D1) ; port BT3
BT4: BT1.1 U1.61(PD14/TIM4_CH3/FMPI2C1_SCL/SAI2_SCK_A/FMC_D0) ; port BT4
CLK: U1.24(PA2/TIM2_CH3/TIM5_CH3/TIM9_CH1/USART2_TX/SAI2_SCK_B/ADC123_IN2) ; port CLK
DAC_OU1: U1.28(PA4/SPI1_NSS/I2S1_WS/SPI3_NSS/I2S3_WS/USART2_CK/OTG_HS_SOF/DCMI_HSYNC/ADC12_IN4/DAC_OUT1) ; port DAC_OU1
DAC_OU2: U1.29(PA5/TIM2_CH1/TIM2_ETR/TIM8_CH1N/SPI1_SCK/I2S1_CK/OTG_HS_ULPI_CK/ADC12_IN5/DAC_OUT2) ; port DAC_OU2
FXOSC_IN: C14.1 Y1.1(X1) ; port FXOSC_IN
FXOSC_OUT: C13.1 Y1.3(X2) ; port FXOSC_OUT
G1: U1.2(PE3/TRACED0/SAI1_SD_B/FMC_A19) ; port G1
G2: U1.5(PE6/TRACED3/TIM9_CH2/SPI4_MOSI/SAI1_SD_A/FMC_A22/DCMI_D7) ; port G2
G3: U1.39(PE9/TIM1_CH1/QUADSPI_BK2_IO2/FMC_D6) ; port G3
G4: U1.42(PE12/TIM1_CH3N/SPI4_SCK/SAI2_SCK_B/FMC_D9) ; port G4
G5: U1.35(PB1/TIM1_CH3N/TIM3_CH4/TIM8_CH3N/OTG_HS_ULPI_D2/SDIO_D2/ADC12_IN9) ; port G5
G6: U1.90(PB4/NJTRST/TIM3_CH1/I2C3_SDA/SPI1_MISO/SPI3_MISO/SPI2_NSS/I2S2_WS) ; port G6
G7: U1.93(PB7/TIM4_CH2/I2C1_SDA/USART1_RX/SPDIFRX_IN0/FMC_NL/DCMI_VSYNC) ; port G7
G8: U1.46(PB10/TIM2_CH3/I2C2_SCL/SPI2_SCK/I2S2_CK/SAI1_SCK_A/USART3_TX/OTG_HS_ULPI_D3) ; port G8
IR: U1.98(PE1/FMC_NBL1/DCMI_D3) ; port IR
LA: U1.15(PC0/SAI1_MCLK_B/OTG_HS_ULPI_STP/FMC_SDNWE/ADC123_IN10) ; port LA
LAT: U1.22(PA0WKUP(PA0)/TIM2_CH1/TIM2_ETR/TIM5_CH1/TIM8_ETR/USART2_CTS/UART4_TX/ADC123_IN0/WKUP0/TAMP_2) ; port LAT
LB: U1.16(PC1/SPI3_MOSI/I2S3_SD/SAI1_SD_A/SPI2_MOSI/I2S2_SD/ADC123_IN11) ; port LB
LC: U1.17(PC2/SPI2_MISO/OTG_HS_ULPI_DIR/FMC_SDNE0/ADC123_IN12) ; port LC
LD: U1.18(PC3/SPI2_MOSI/I2S2_SD/OTG_HS_ULPI_NXT/FMC_SDCKE0/ADC123_IN13) ; port LD
LE: U1.32(PC4/I2S1_MCK/SPDIFRX_IN2/FMC_SDNE0/ADC12_IN14) ; port LE
NRST: C15.1 R2.2 ; port NRST
OE: U1.23(PA1/TIM2_CH2/TIM5_CH2/USART2_RTS/UART4_RX/QUADSPI_BK1_IO3/SAI2_MCLK_B/ADC123_IN1) ; port OE
R1: U1.1(PE2/TRACECLK/SPI4_SCK/SAI1_MCLK_A/QUADSPI_BK1_IO2/FMC_A23) ; port R1
R2: U1.4(PE5/TRACED2/TIM9_CH1/SPI4_MISO/SAI1_SCK_A/FMC_A21/DCMI_D6) ; port R2
R3: U1.38(PE8/TIM1_CH1N/UART5_TX/QUADSPI_BK2_IO1/FMC_D5) ; port R3
R4: U1.41(PE11/TIM1_CH2/SPI4_NSS/SAI2_SD_B/FMC_D8) ; port R4
R5: U1.34(PB0/TIM1_CH2N/TIM3_CH3/TIM8_CH2N/SPI3_MOSI/I2S3_SD/UART4_CTS/OTG_HS_ULPI_D1/SDIO_D1/ADC12_IN8) ; port R5
R6: U1.89(PB3/JTDO/TRACESWO/TIM2_CH2/I2C2_SDA/SPI1_SCK/I2S1_CK/SPI3_SCK/I2S3_CK) ; port R6
R7: U1.92(PB6/TIM4_CH1/HDMI_CEC/I2C1_SCL/USART1_TX/CAN2_TX/QUADSPI_BK1_NCS/FMC_SDNE1/DCMI_D5) ; port R7
R8: U1.96(PB9/TIM2_CH2/TIM4_CH4/TIM11_CH1/I2C1_SDA/SPI2_NSS/I2S2_WS/SAI1_FS_B/CAN1_TX/SDIO_D5/DCMI_D7) ; port R8
RTC_INT: U1.69(PA10/TIM1_CH3/USART1_RX/OTG_FS_ID/DCMI_D1) U2.3(~{INT}) ; port RTC_INT
SCL: U1.59(PD12/TIM4_CH1/FMPI2C1_SCL/USART3_RTS/QUADSPI_BK1_IO1/SAI2_FS_A/FMC_A17) U2.16(SCL) ; port SCL
SD_CD: U1.67(PA8/MCO1/TIM1_CH1/I2C3_SCL/USART1_CK/OTG_FS_SOF) ; port SD_CD
SD_CLK: U1.80(PC12/I2C2_SDA/SPI3_MOSI/I2S3_SD/USART3_CK/UART5_TX/SDIO_CK/DCMI_D9) ; port SD_CLK
SD_CMD: U1.83(PD2/TIM3_ETR/UART5_RX/SDIO_CMD/DCMI_D11) ; port SD_CMD
SD_DAT0: U1.65(PC8/TRACED0/TIM3_CH3/TIM8_CH3/UART5_RTS/USART6_CK/SDIO_D0/DCMI_D2) ; port SD_DAT0
SD_DAT1: U1.66(PC9/MCO2/TIM3_CH4/TIM8_CH4/I2C3_SDA/I2S_CKIN/UART5_CTS/QUADSPI_BK1_IO0/SDIO_D1/DCMI_D3) ; port SD_DAT1
SD_DAT2: U1.78(PC10/SPI3_SCK/I2S3_CK/USART3_TX/UART4_TX/QUADSPI_BK1_IO1/SDIO_D2/DCMI_D8) ; port SD_DAT2
SD_DAT3: U1.79(PC11/SPI3_MISO/USART3_RX/UART4_RX/QUADSPI_BK2_NCS/SDIO_D3/DCMI_D4) ; port SD_DAT3
SDA: U1.60(PD13/TIM4_CH2/FMPI2C1_SDA/QUADSPI_BK1_IO3/SAI2_SCK_A/FMC_A18) U2.15(SDA) ; port SDA
SWCLK: U1.76(PA14/JTCKSWCLK) ; port SWCLK
SWDIO: U1.72(PA13/JTMSSWDIO) ; port SWDIO
VBAT: U2.14(VBAT) ; port VBAT

Not connected (* = marked no-connect by the designer): U1 7(PC13/TAMP_1/WKUP1) 25(PA3/TIM2_CH4/TIM5_CH4/TIM9_CH2/SAI1_FS_A/USART2_RX/OTG_HS_ULPI_D0/ADC123_IN3) 33(PC5/USART3_RX/SPDIFRX_IN3/FMC_SDCKE0/ADC12_IN15) 44(PE14/TIM1_CH4/SPI4_MOSI/SAI2_MCLK_B/FMC_D11)* 45(PE15/TIM1_BKIN/FMC_D12)* 51(PB12/TIM1_BKIN/I2C2_SMBA/SPI2_NSS/I2S2_WS/SAI1_SCK_B/USART3_CK/CAN2_RX/OTG_HS_ULPI_D5/OTG_HS_ID) 52(PB13/TIM1_CH1N/SPI2_SCK/I2S2_CK/USART3_CTS/CAN2_TX/OTG_HS_ULPI_D6/OTG_HS_VBUS) 53(PB14/TIM1_CH2N/TIM8_CH2N/SPI2_MISO/USART3_RTS/TIM12_CH1/OTG_HS_DM) 54(PB15/RTC_REFIN/TIM1_CH3N/TIM8_CH3N/SPI2_MOSI/I2S2_SD/TIM12_CH2/OTG_HS_DP) 55(PD8/USART3_TX/SPDIFRX_IN1/FMC_D13) 56(PD9/USART3_RX/FMC_D14) 57(PD10/USART3_CK/FMC_D15) 58(PD11/FMPI2C1_SMBA/USART3_CTS/QUADSPI_BK1_IO0/SAI2_SD_A/FMC_A16) 68(PA9/TIM1_CH2/I2C3_SMBA/SPI2_SCK/I2S2_CK/SAI1_SD_B/USART1_TX/DCMI_D0/OTG_FS_VBUS) 70(PA11/TIM1_CH4/USART1_CTS/CAN1_RX/OTG_FS_DM) 71(PA12/TIM1_ETR/USART1_RTS/SAI2_FS_B/CAN1_TX/OTG_FS_DP) 77(PA15/JTDI/TIM2_CH1/TIM2_ETR/HDMI_CEC/SPI1_NSS/I2S1_WS/SPI3_NSS/I2S3_WS/UART4_RTS) 81(PD0/SPI4_MISO/SPI3_MOSI/I2S3_SD/CAN1_RX/FMC_D2) 82(PD1/SPI2_NSS/I2S2_WS/CAN1_TX/FMC_D3) 84(PD3/TRACED1/SPI2_SCK/I2S2_CK/USART2_CTS/QUADSPI_CLK/FMC_CLK/DCMI_D5) 85(PD4/USART2_RTS/FMC_NOE) 86(PD5/USART2_TX/FMC_NWE) 87(PD6/SPI3_MOSI/I2S3_SD/SAI1_SD_A/USART2_RX/FMC_NWAIT/DCMI_D10) 88(PD7/USART2_CK/SPDIFRX_IN0/FMC_NE1) 97(PE0/TIM4_ETR/SAI2_MCLK_A/FMC_NBL0/DCMI_D2); U2 1(32kHz)* 4(~{RST})*

### Notes on the sheet
- MCU
- DESIGN NOTE:
  Wrong pinout, need changing Pin 1-3 to GND and Pin 2-4 to FX
- CONFIDENTAL. Do not distribute.
- Variant:
- Checked by
- Designed by THAMKHANH
- (in symbol SDTitleBlock) Title:; Page Contents:; Revision:; Size:; DWG NO; Date:; Sheet; of

### Library data of the parts
BT1-BT4 = Button 2: Button 2 Pin no Sheld
C13-C15 = CAP-SMD-CERAMIC: as C1 on sheet [03] - POWER; RoHS: RoHS Compliant; Category: Capacitors; Mounting Type: Surface Mount, MLCC; Operating Temperature: -55°C ~ 85°C; Applications: General Purpose; Ratings: -; Package / Case: 0805 (2012 Metric); Size / Dimension: 0.079" L x 0.049" W (2.00mm x 1.25mm); Height - Seated (Max): -; Thickness (Max): 0.057" (1.45mm); Lead Spacing: -; Features: -; Packaging: Cut Tape (CT); Lead Style: -; ComponentLink1URL: http://www.tdk.com/pdf/general_B11.pdf; ComponentLink1Description: http://www.tdk.com/pdf/general_B11.pdf; .Checked SCH: RF
R2 R3 = RES-SMD: as R1 on sheet [03] - POWER; Category: Resistors; Supplier Part Number: 311-49.9LRCT-ND; Package / Case: 0402 (1005 Metric); Price 1k [$]: 0.01421; Tolerance: ±1%; Value: 0R; .Checked SCH: used; Supplier: Digikey; RoHS: RoHS Compliant; Composition: Thick Film; Features: -; Size / Dimension: 0.039" L x 0.020" W (1.00mm x 0.50mm); Height: 0.016" (0.40mm); Number of Terminations: 2; Packaging: Cut Tape (CT); ComponentLink1URL: http://www.yageo.com/documents/recent/PYu-RC0402_51_RoHS_L_6.pdf; ComponentLink1Description: http://www.yageo.com/documents/recent/PYu-RC0402_51_RoHS_L_6.pdf; Resistance (Ohms): 0R; Mount: Surface Mount; Case/Package: 0805; Number of Pins: 2; Contact Plating: Tin; Case Code (Metric): 2012; Case Code (Imperial): 0805; Min Operating Temperature: -55°C; Max Operating Temperature: 155°C; Package Quantity: 1; Termination: SMD/SMT; Military Standard: Not; Max Power Dissipation: 125mW; Voltage Rating (DC): 100V; Length: 2mm; Width: 1.25mm; Depth: 1.25mm; Radiation Hardening: No; REACH SVHC: No SVHC; Lead Free: Lead Free; ComponentLink2URL: http://www.farnell.com/datasheets/485442.pdf?src-supplier=Farnell; ComponentLink2Description: http://www.farnell.com/datasheets/485442.pdf?src-supplier=Farnell; ComponentLink3URL: http://uk.rs-online.com/webdocs/0bee/0900766b80beefcc.pdf?src-supplier=RSComponents; ComponentLink3Description: http://uk.rs-online.com/webdocs/0bee/0900766b80beefcc.pdf?src-supplier=RSComponents; ComponentLink4URL: http://industrial.panasonic.com/www-data/pdf/AOA0000/AOA0000CE26.pdf?src-supplier=Future+Electronics; ComponentLink4Description: http://industrial.panasonic.com/www-data/pdf/AOA0000/AOA0000CE26.pdf?src-supplier=Future+Electronics; ComponentLink5URL: https://www.alliedelec.com/m/d/b6b0537e86f421aa7f5975bb1d8f429a.pdf?src-supplier=Allied+Electronics; ComponentLink5Description: https://www.alliedelec.com/m/d/b6b0537e86f421aa7f5975bb1d8f429a.pdf?src-supplier=Allied+Electronics; ComponentLink6URL: http://industrial.panasonic.com/www-data/pdf/AOA0000/AOA0000CE26.pdf?src-supplier=Avnet; ComponentLink6Description: http://industrial.panasonic.com/www-data/pdf/AOA0000/AOA0000CE26.pdf?src-supplier=Avnet; ComponentLink7URL: http://industrial.panasonic.com/www-data/pdf/AOA0000/AOA0000CE26.pdf?src-supplier=Avnet+Europe; ComponentLink7Description: http://industrial.panasonic.com/www-data/pdf/AOA0000/AOA0000CE26.pdf?src-supplier=Avnet+Europe; ComponentLink8URL: http://industrial.panasonic.com/cdbs/www-data/pdf/RDM0000/AOA0000C307.pdf?src-supplier=Farnell; ComponentLink8Description: http://industrial.panasonic.com/cdbs/www-data/pdf/RDM0000/AOA0000C307.pdf?src-supplier=Farnell; ComponentLink9URL: https://www.distrelec.biz/Web/Downloads/_t/ds/ERA_eng_tds.pdf?mime=application%2Fpdf&src-supplier=Distrelec; ComponentLink9Description: https://www.distrelec.biz/Web/Downloads/_t/ds/ERA_eng_tds.pdf?mime=application%2Fpdf&src-supplier=Distrelec; ComponentLink10URL: http://www.farnell.com/datasheets/485442.pdf?src-supplier=Element14; ComponentLink10Description: http://www.farnell.com/datasheets/485442.pdf?src-supplier=Element14; ComponentLink11URL: http://www.farnell.com/datasheets/2052875.pdf?src-supplier=Farnell; ComponentLink11Description: http://www.farnell.com/datasheets/2052875.pdf?src-supplier=Farnell; ComponentLink12URL: http://www.farnell.com/datasheets/2059650.pdf?src-supplier=Farnell; ComponentLink12Description: http://www.farnell.com/datasheets/2059650.pdf?src-supplier=Farnell; ComponentLink13URL: https://produktinfo.conrad.com/datenblaetter/450000-474999/453184-da-01-en-WIDERSTAND_0805_ERA.pdf?src-supplier=Conrad; ComponentLink13Description: https://produktinfo.conrad.com/datenblaetter/450000-474999/453184-da-01-en-WIDERSTAND_0805_ERA.pdf?src-supplier=Conrad
U1 = STM32H750VBT6: as U1 on sheet [03] - POWER; Manufacturer: STMicroelectronics; Manufacturer Part Number: STM32H750VBT6; Mount: Surface Mount; Case/Package: LQFP; Min Operating Temperature: -40°C; Max Operating Temperature: 85°C; Packaging: Tray; ComponentLink1URL: http://www.farnell.com/datasheets/2710930.pdf?src-supplier=Farnell; ComponentLink1Description: http://www.farnell.com/datasheets/2710930.pdf?src-supplier=Farnell; ComponentLink2URL: https://www.st.com/resource/en/errata_sheet/dm00399555.pdf?src-supplier=Digi-Key; ComponentLink2Description: https://www.st.com/resource/en/errata_sheet/dm00399555.pdf?src-supplier=Digi-Key; ComponentLink3URL: http://www.farnell.com/datasheets/2710930.pdf?src-supplier=Element14; ComponentLink3Description: http://www.farnell.com/datasheets/2710930.pdf?src-supplier=Element14; ComponentLink4URL: http://www.farnell.com/datasheets/2710930.pdf?src-supplier=Newark; ComponentLink4Description: http://www.farnell.com/datasheets/2710930.pdf?src-supplier=Newark
U2 = DS3231SN: RTC, TCXO, CRYSTAL, 3.3V, 16SOIC; Manufacturer: Maxim; Max Supply Voltage: 5.5V; Min Supply Voltage: 2.3V; Logic Function: Clock; Time Format: HH:MM:SS; Date Format: YY-MM-DD-dd; Interface: I2C,Serial,2-Wire; Number of Outputs: 1; Frequency: 32.768kHz; Manufacturer Part Number: DS3231SN; Mount: Surface Mount; Case/Package: SOIC; Number of Pins: 16; Weight: 0.023492oz; Min Operating Temperature: -40°C; Max Operating Temperature: 85°C; Package Quantity: 46; Packaging: Bulk; Operating Supply Voltage: 3.3V; Termination: SMD/SMT; Length: 10.5mm; Height: 2.35mm; Width: 7.6mm; Radiation Hardening: No; REACH SVHC: Unknown; Lead Free: Lead Free; ComponentLink1URL: https://datasheets.maximintegrated.com/en/ds/DS3231-DS3231S.pdf?src-supplier=Digi-Key; ComponentLink1Description: https://datasheets.maximintegrated.com/en/ds/DS3231-DS3231S.pdf?src-supplier=Digi-Key; ComponentLink2URL: http://datasheets.maxim-ic.com/en/ds/DS3231.pdf?src-supplier=Avnet+Europe; ComponentLink2Description: http://datasheets.maxim-ic.com/en/ds/DS3231.pdf?src-supplier=Avnet+Europe; ComponentLink3URL: http://www.farnell.com/datasheets/1675711.pdf?src-supplier=Element14; ComponentLink3Description: http://www.farnell.com/datasheets/1675711.pdf?src-supplier=Element14; ComponentLink4URL: http://www.mouser.com/ds/2/256/DS3231-102175.pdf?src-supplier=Mouser; ComponentLink4Description: http://www.mouser.com/ds/2/256/DS3231-102175.pdf?src-supplier=Mouser; ComponentLink5URL: http://datasheets.maximintegrated.com/en/ds/DS3231.pdf?src-supplier=Avnet; ComponentLink5Description: http://datasheets.maximintegrated.com/en/ds/DS3231.pdf?src-supplier=Avnet; ComponentLink6URL: http://datasheet.iiic.cc/maxim/DS3231SN_.pdf?src-supplier=IIIC; ComponentLink6Description: http://datasheet.iiic.cc/maxim/DS3231SN_.pdf?src-supplier=IIIC
Y1 = XT4: XMHz ±30ppm Crystal 20pF 150 Ohm -20°C ~ 70°C  Surface Mount HC49/US; Manufacturer: Abracon; Manufacturer Part Number: ABM8-24.000MHZ-B2-T; ESR (Equivalent Series Resistance): 50R; Frequency: 24MHz; Load Capacitance: 18pF; Tolerance: 20ppm; Frequency Stability: 50ppm; Mount: Surface Mount; Case/Package: CSMD; Number of Pins: 4; Min Operating Temperature: -20°C; Max Operating Temperature: 70°C; Package Quantity: 1000; Packaging: Tape and Reel; Frequency Tolerance: 20ppm; Termination: SMD/SMT; Series Resistance: 50R; Composition: Ceramic; Accuracy: 20ppm; Length: 3.2mm; Height: 0.031inch; Depth: 2.5mm; Width: 2.5mm; Radiation Hardening: No; REACH SVHC: No SVHC; Lead Free: Lead Free; ComponentLink1URL: http://www.mouser.com/ds/2/3/abm8-16794.pdf?src-supplier=Mouser; ComponentLink1Description: http://www.mouser.com/ds/2/3/abm8-16794.pdf?src-supplier=Mouser; ComponentLink2URL: http://www.farnell.com/datasheets/97450.pdf?src-supplier=Element14; ComponentLink2Description: http://www.farnell.com/datasheets/97450.pdf?src-supplier=Element14; ComponentLink3URL: http://www.abracon.com/Resonators/abm8.pdf?src-supplier=Element14; ComponentLink3Description: http://www.abracon.com/Resonators/abm8.pdf?src-supplier=Element14; ComponentLink4URL: https://www.verical.com/server-webapp/html/getDatasheet?partID=719846&src-supplier=Verical; ComponentLink4Description: https://www.verical.com/server-webapp/html/getDatasheet?partID=719846&src-supplier=Verical; ComponentLink5URL: https://abracon.com/Support/PackageDrawing/Resonators/ABM8.PDF?src-supplier=Digi-Key; ComponentLink5Description: https://abracon.com/Support/PackageDrawing/Resonators/ABM8.PDF?src-supplier=Digi-Key; ComponentLink6URL: http://www.abracon.com/Resonators/abm8.pdf?src-supplier=Digi-Key; ComponentLink6Description: http://www.abracon.com/Resonators/abm8.pdf?src-supplier=Digi-Key; ComponentLink7URL: http://www.abracon.com/Resonators/abm8.pdf?src-supplier=Future+Electronics; ComponentLink7Description: http://www.abracon.com/Resonators/abm8.pdf?src-supplier=Future+Electronics; ComponentLink8URL: http://www.abracon.com/Resonators/abm8.pdf?src-supplier=Farnell; ComponentLink8Description: http://www.abracon.com/Resonators/abm8.pdf?src-supplier=Farnell

## Sheet [05] - FLASH, MICROSD.SchDoc
size A3; DocumentNumber: 6; SheetNumber: 5; SheetTotal: 10
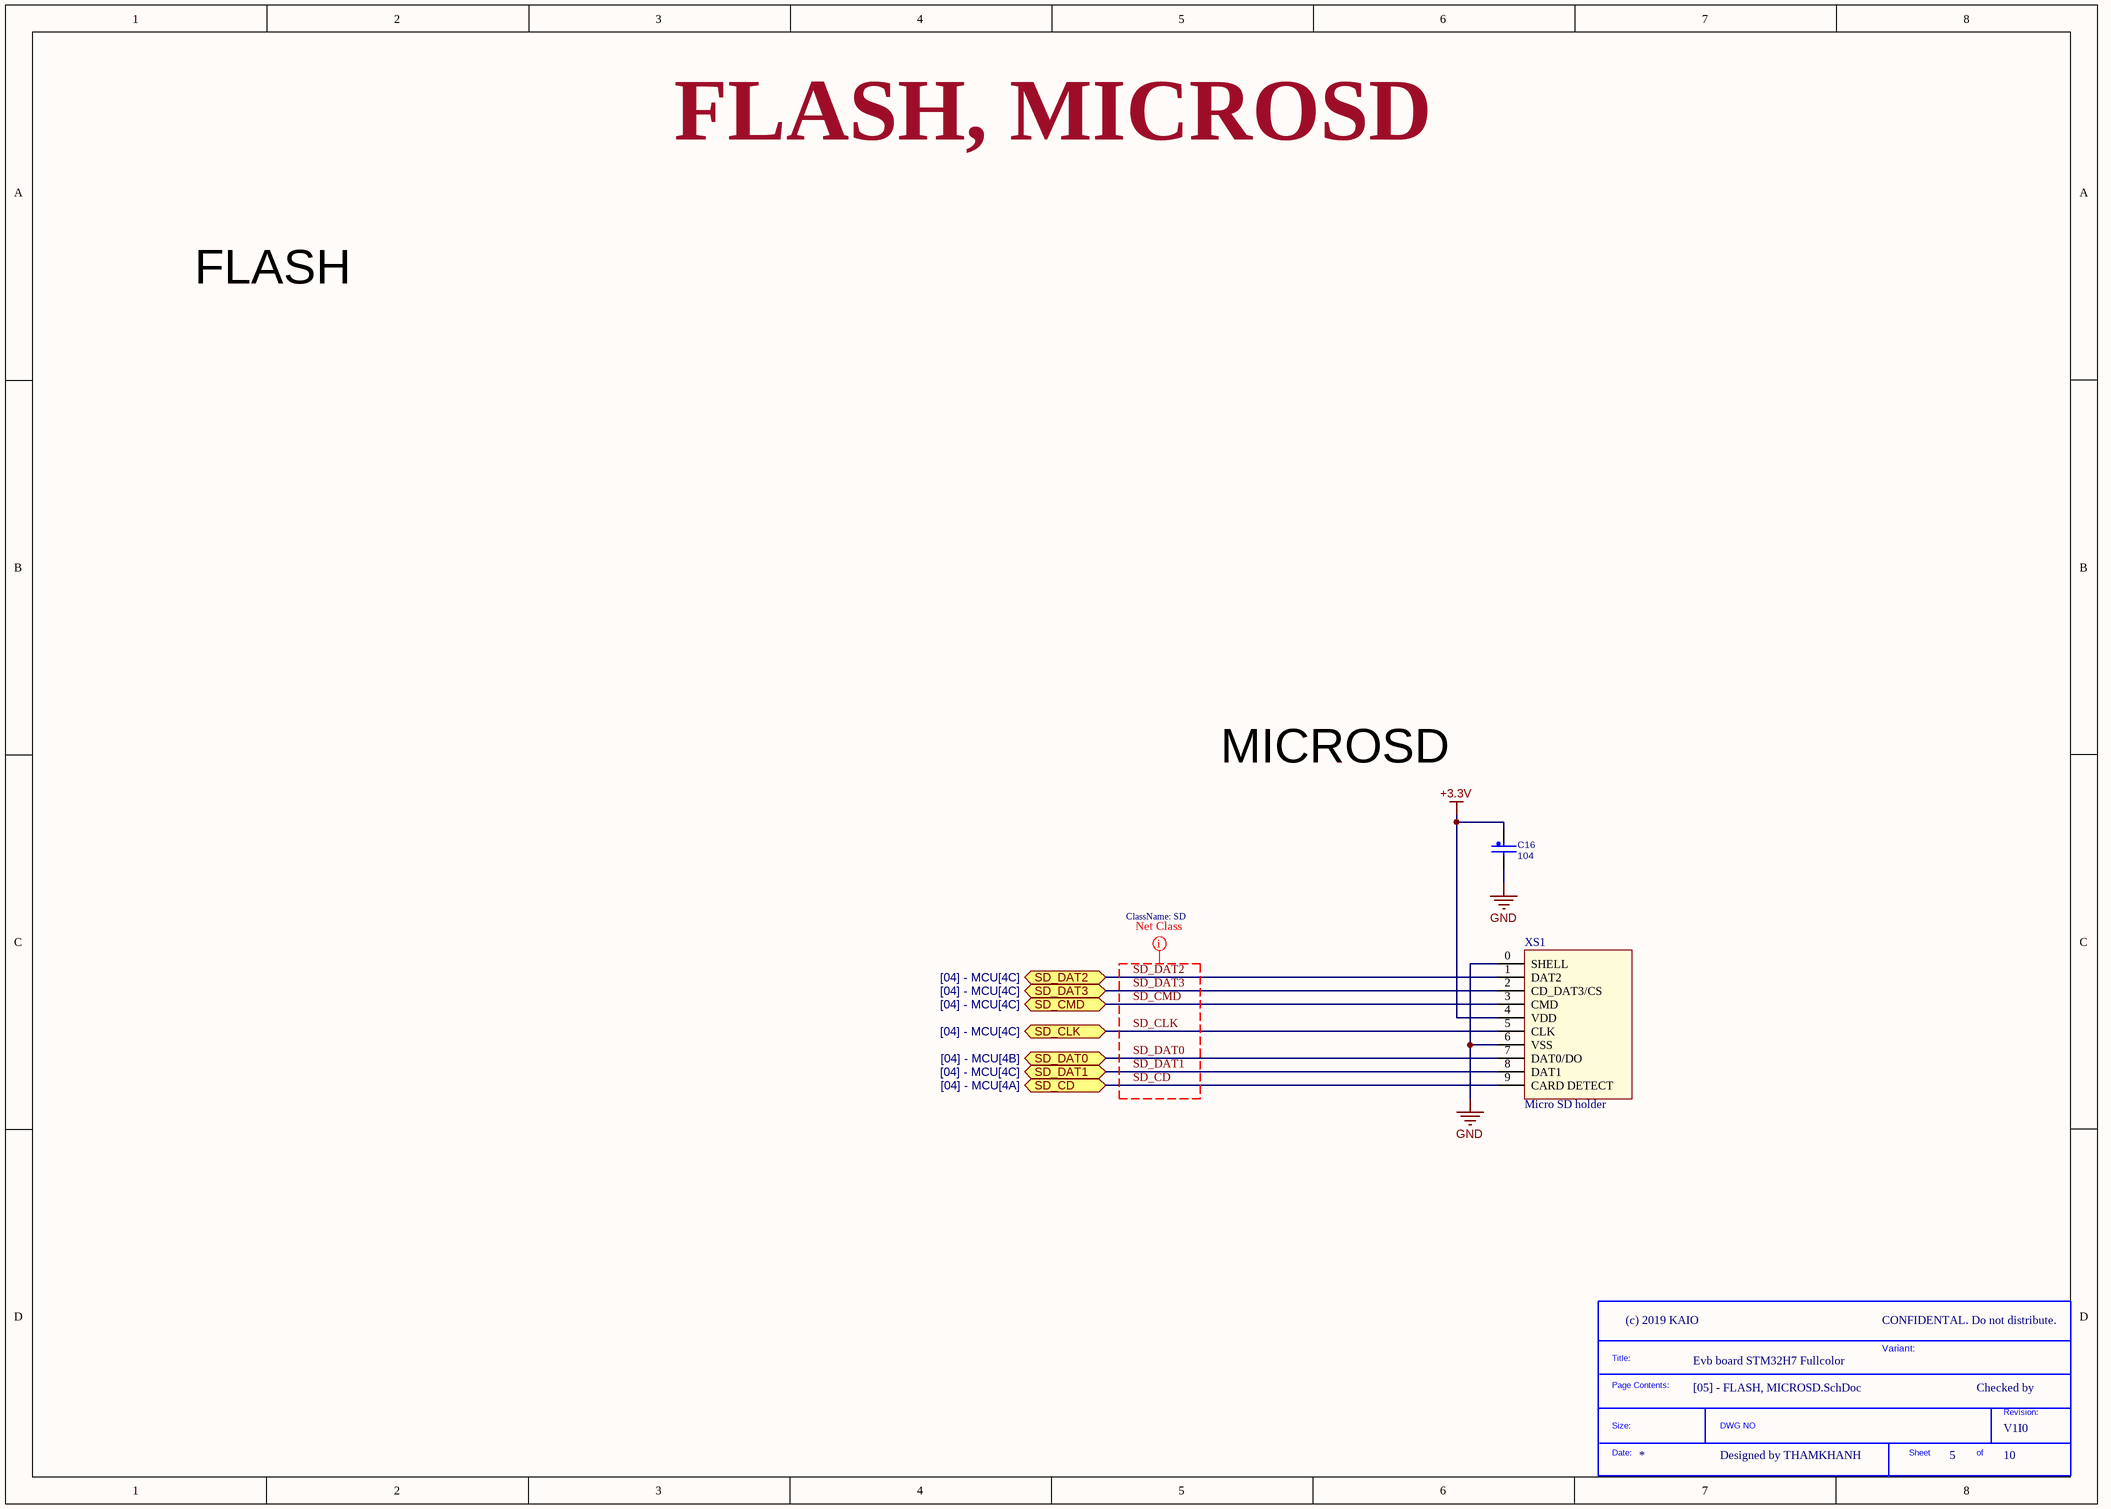
[diagram p5: [05] - FLASH, MICROSD.SchDoc]

### Parts
(Parts that share a designator on the sheet are numbered #1, #2 ... from top to bottom, then left to right.)
*?#5  SDTitleBlock  (value not drawn)  (graphical)
C16  104  [C0603]
XS1  Micro SD holder  [SD-CARD-MICRO-V3]

### Ports
SD_CD (bidir, see [04] - MCU[4A]), SD_CLK (bidir, see [04] - MCU[4C]), SD_CMD (bidir, see [04] - MCU[4C]), SD_DAT0 (bidir, see [04] - MCU[4B]), SD_DAT1 (bidir, see [04] - MCU[4C]), SD_DAT2 (bidir, see [04] - MCU[4C]), SD_DAT3 (bidir, see [04] - MCU[4C])

### Nets
+3.3V: C16.1 XS1.4(VDD)
GND: C16.2 XS1.0(SHELL) XS1.6(VSS)
SD_CD: XS1.9(CARD_DETECT) ; port SD_CD
SD_CLK: XS1.5(CLK) ; port SD_CLK
SD_CMD: XS1.3(CMD) ; port SD_CMD
SD_DAT0: XS1.7(DAT0/DO) ; port SD_DAT0
SD_DAT1: XS1.8(DAT1) ; port SD_DAT1
SD_DAT2: XS1.1(DAT2) ; port SD_DAT2
SD_DAT3: XS1.2(CD_DAT3/CS) ; port SD_DAT3

### Layout directives
net class SD: SD_CD, SD_CLK, SD_CMD, SD_DAT0, SD_DAT1, SD_DAT2, SD_DAT3

### Notes on the sheet
- FLASH, MICROSD
- FLASH
- MICROSD
- CONFIDENTAL. Do not distribute.
- Variant:
- Checked by
- Designed by THAMKHANH
- (in symbol SDTitleBlock) Title:; Page Contents:; Revision:; Size:; DWG NO; Date:; Sheet; of

### Library data of the parts
C16 = CAP-SMD-CERAMIC: as C1 on sheet [03] - POWER; RoHS: RoHS Compliant; Category: Capacitors; Mounting Type: Surface Mount, MLCC; Operating Temperature: -55°C ~ 85°C; Applications: General Purpose; Ratings: -; Package / Case: 0805 (2012 Metric); Size / Dimension: 0.079" L x 0.049" W (2.00mm x 1.25mm); Height - Seated (Max): -; Thickness (Max): 0.057" (1.45mm); Lead Spacing: -; Features: -; Packaging: Cut Tape (CT); Lead Style: -; ComponentLink1URL: http://www.tdk.com/pdf/general_B11.pdf; ComponentLink1Description: http://www.tdk.com/pdf/general_B11.pdf; .Checked SCH: RF
XS1 = SD-CARD-v3